# EasyEDA schematic ProiectPM.json

## Sheets
1 Unitatea Centrala: TITLE: Unitatea Centrala; REV: 1.0; Date: 2024-11-15; Sheet: 1/1; Drawn By: ionescucatalin; Company: Your Company
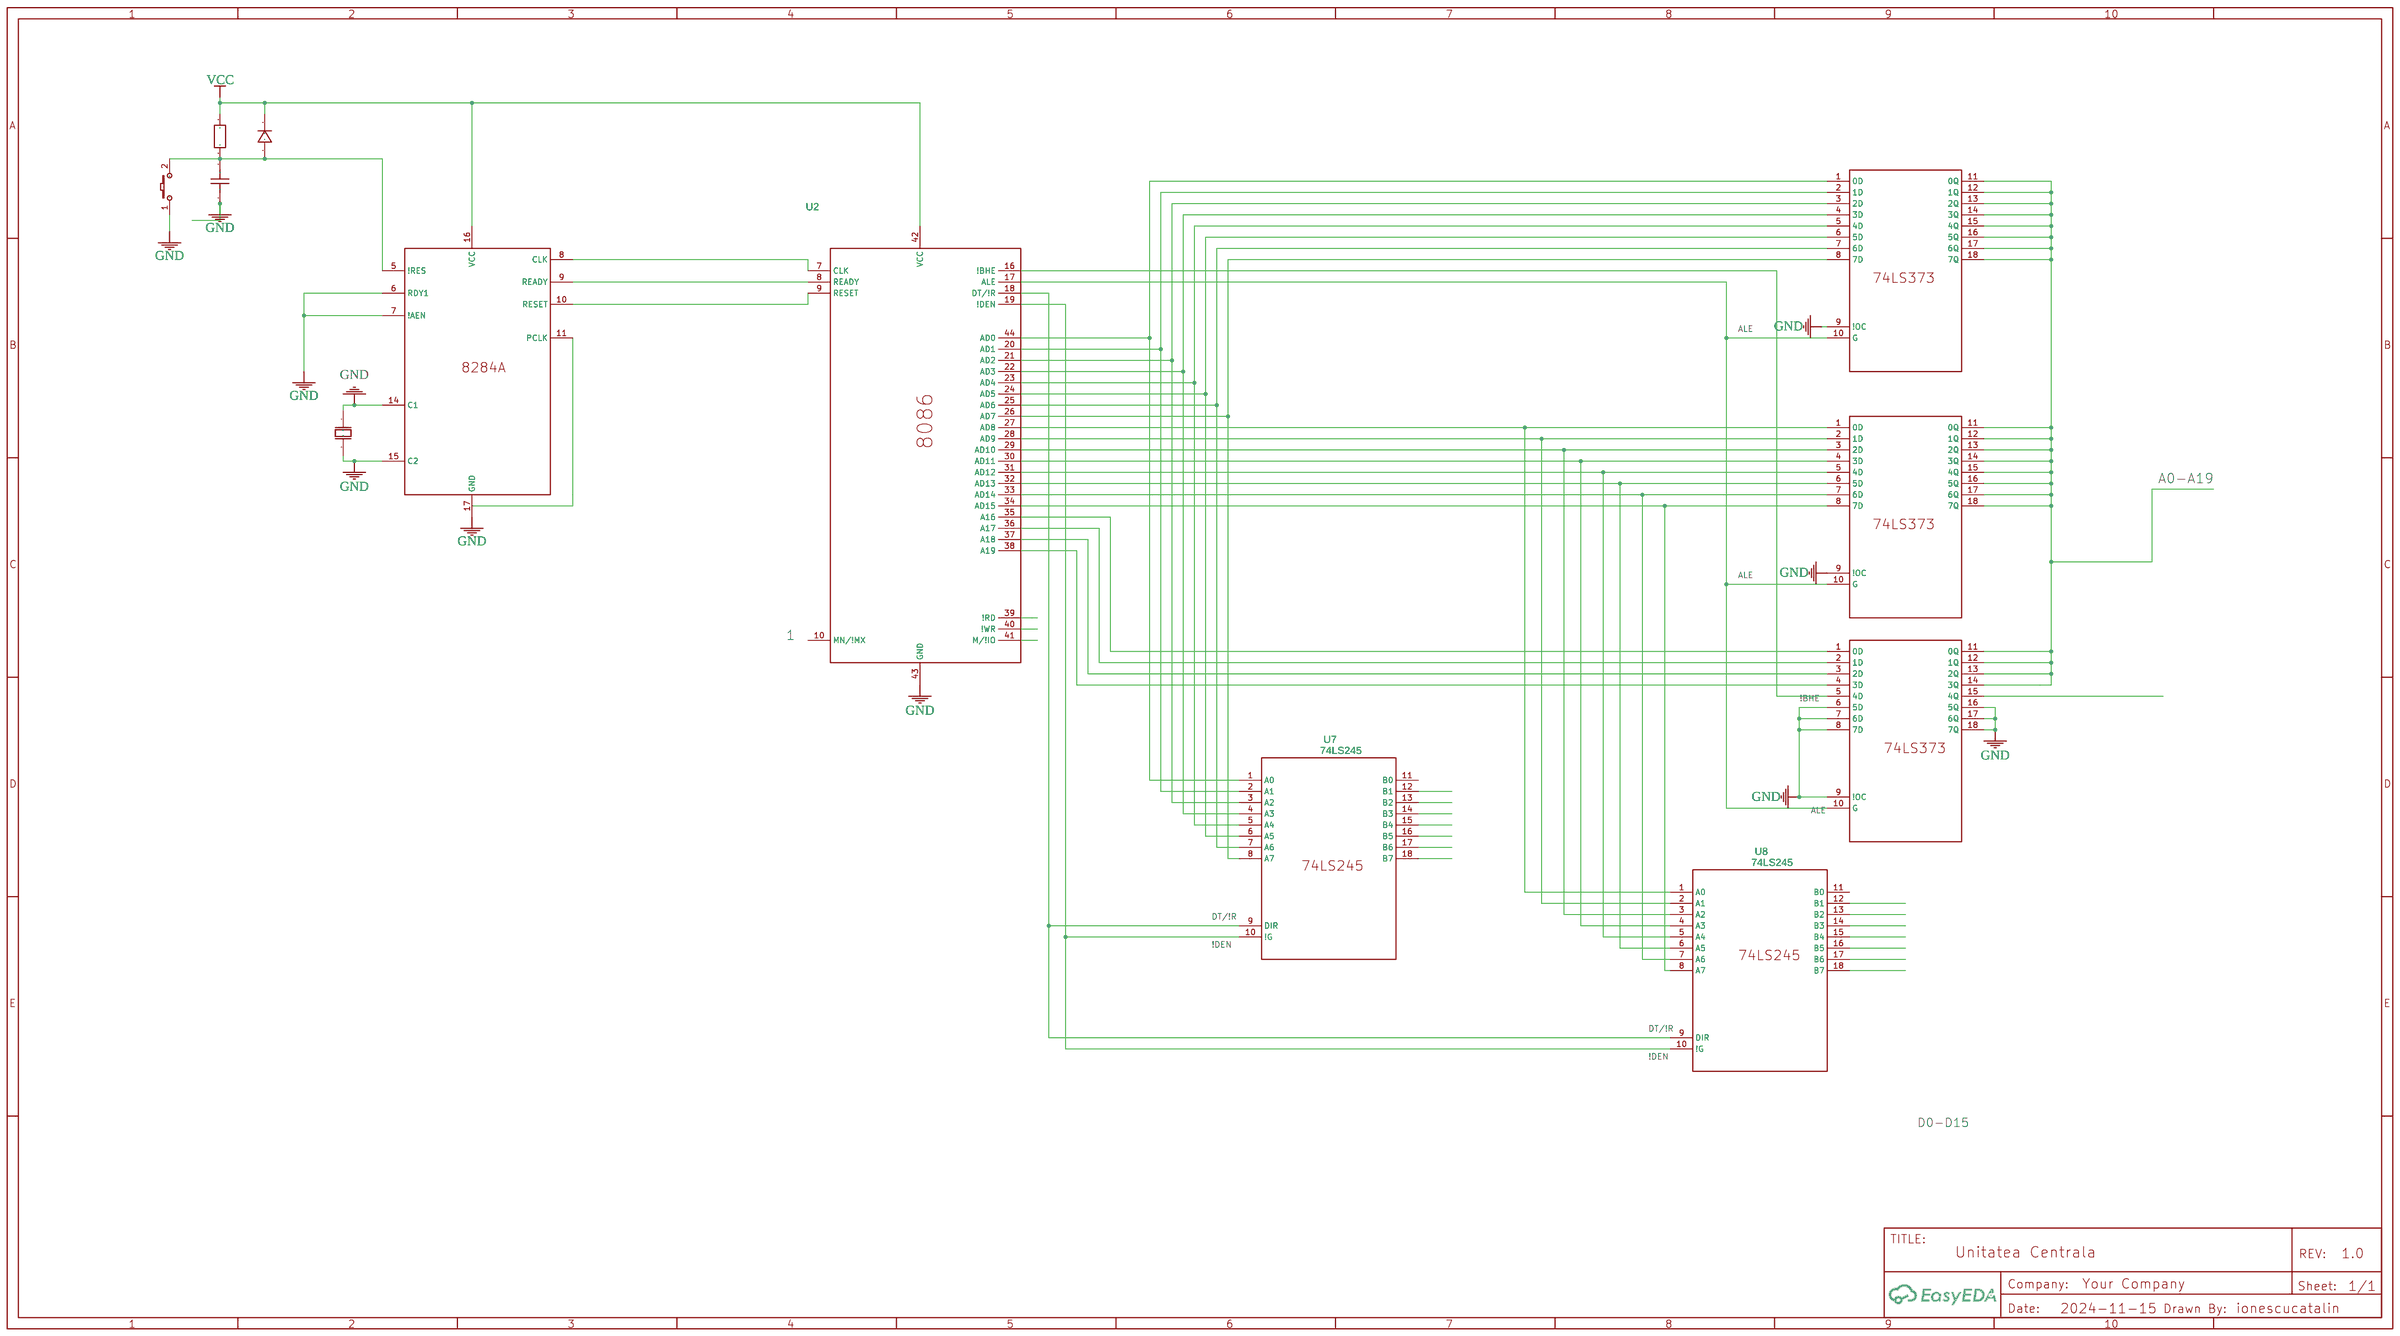
[diagram p0: Unitatea Centrala]
2 ConectareaMemorilor: TITLE: Conectarea Memorilor
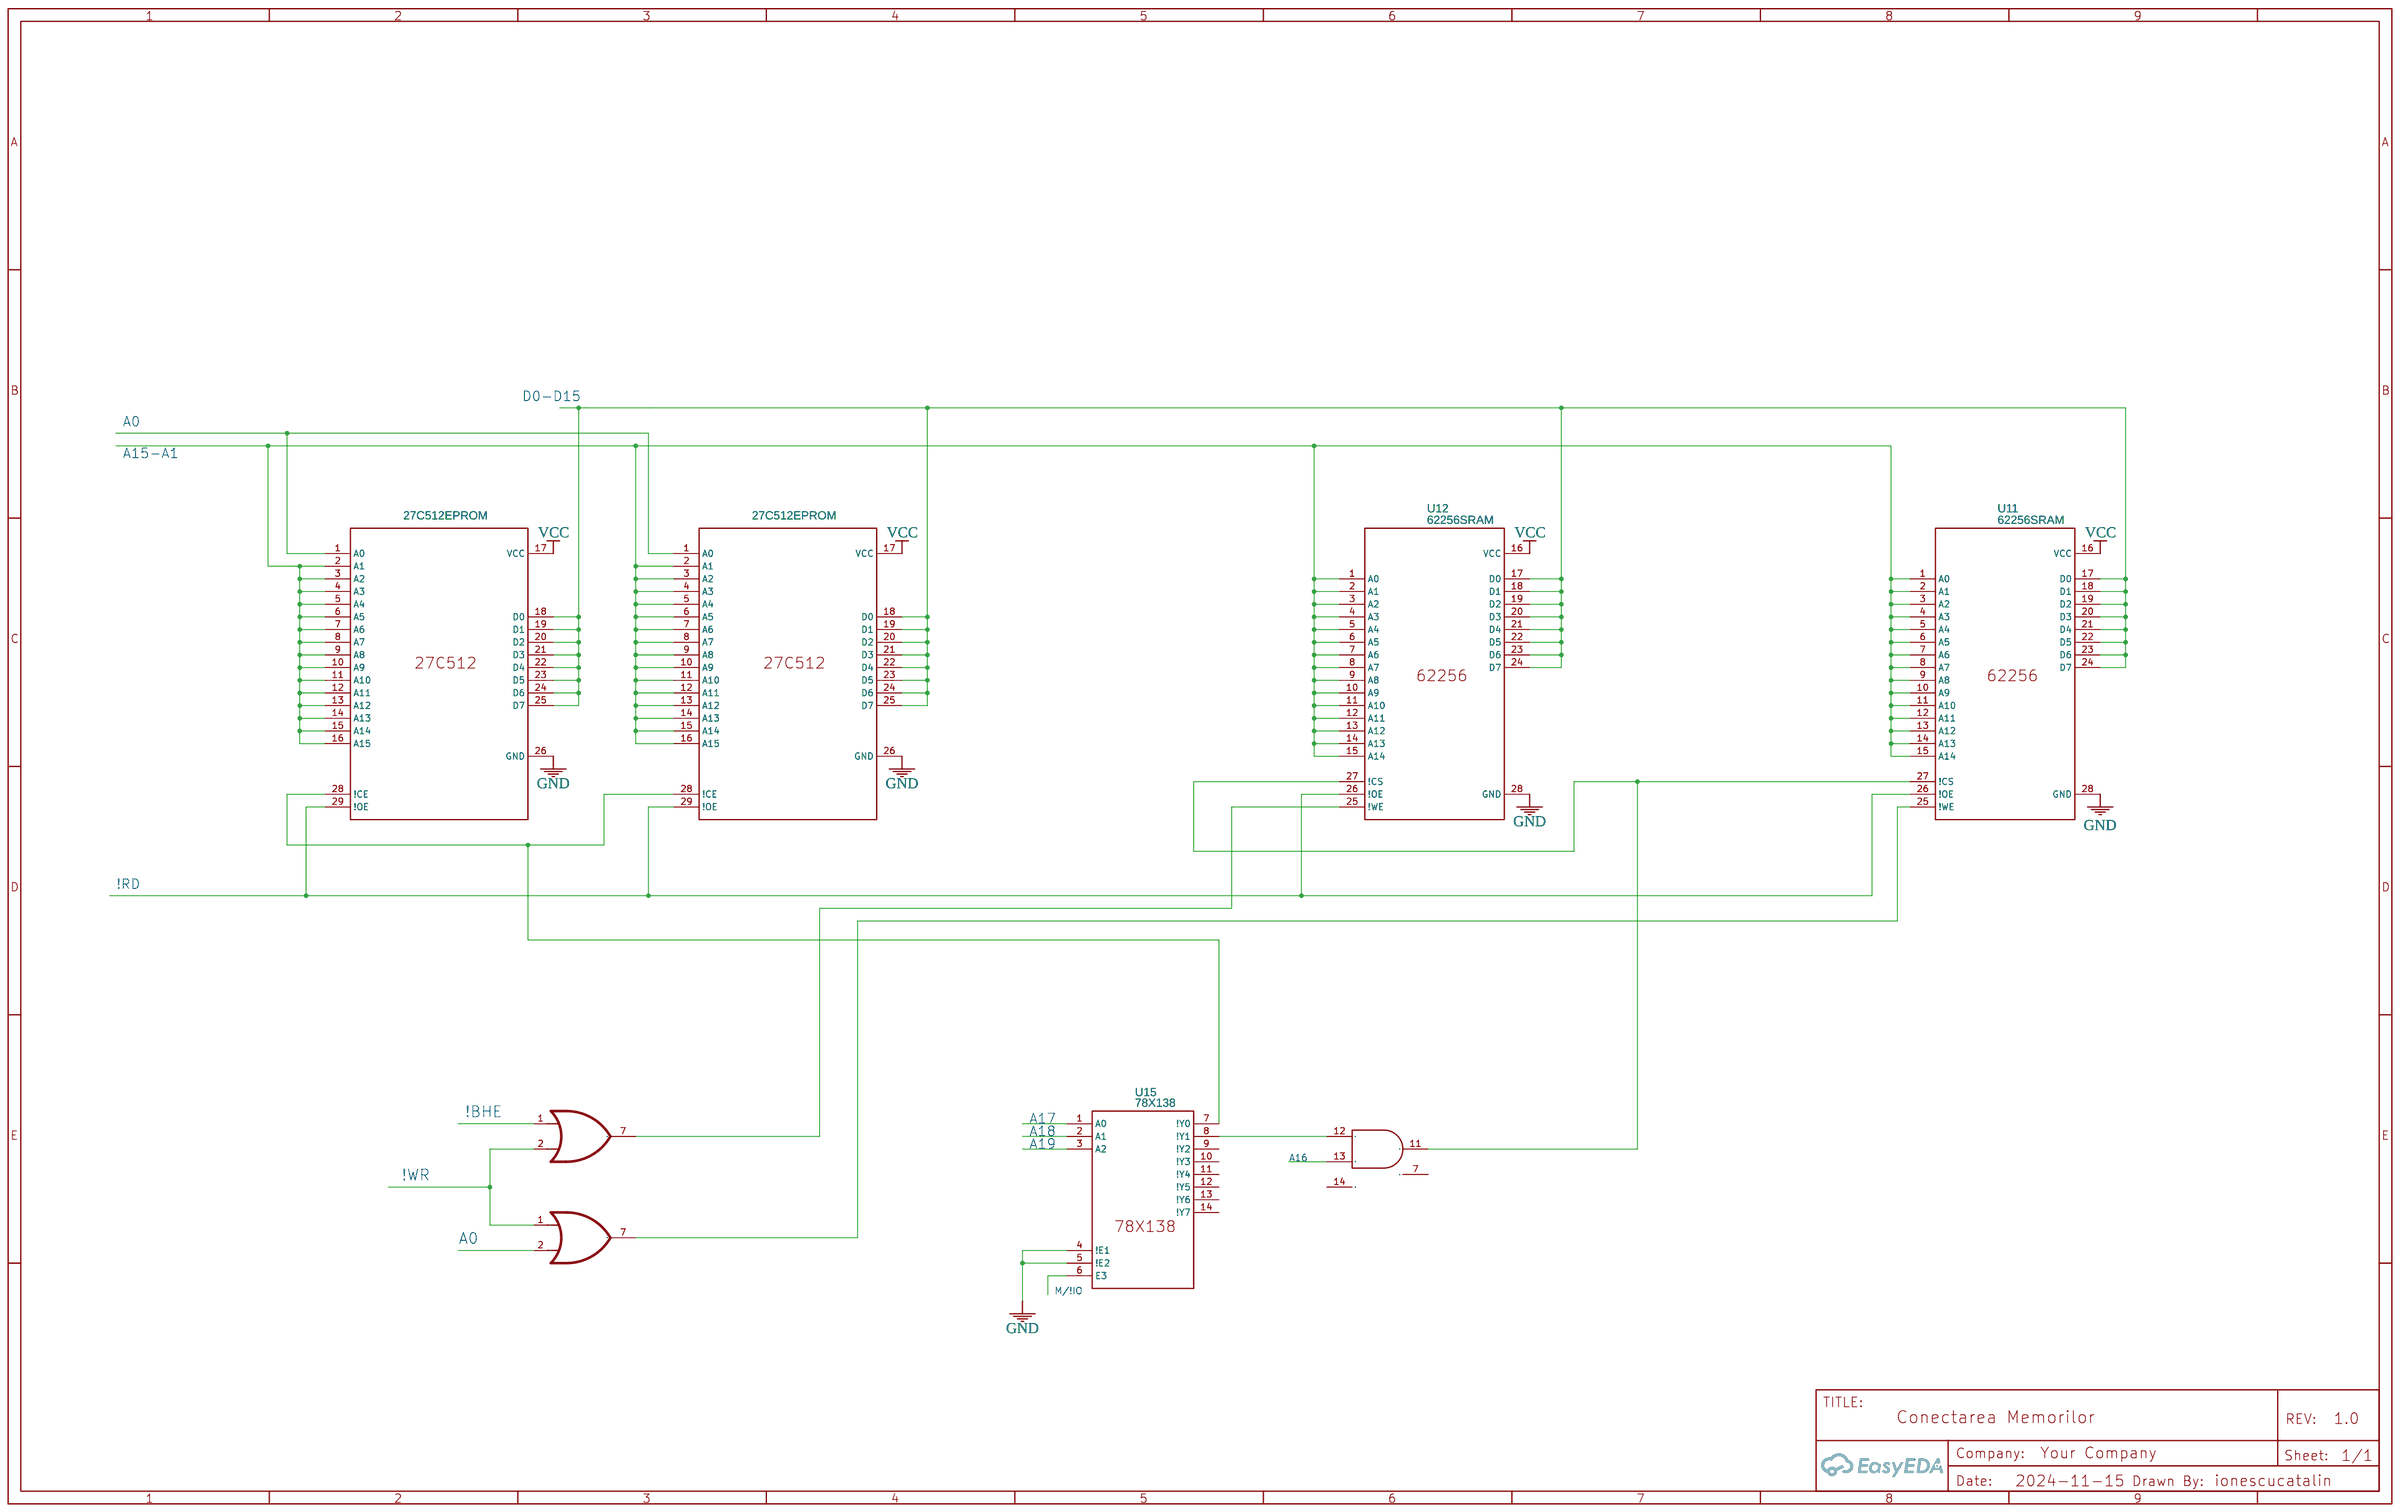
[diagram p1: ConectareaMemorilor]
3 DECINTERFATASERIALAPARA: TITLE: Decodificare Interfata Ser - Para; Date: 2024-11-18
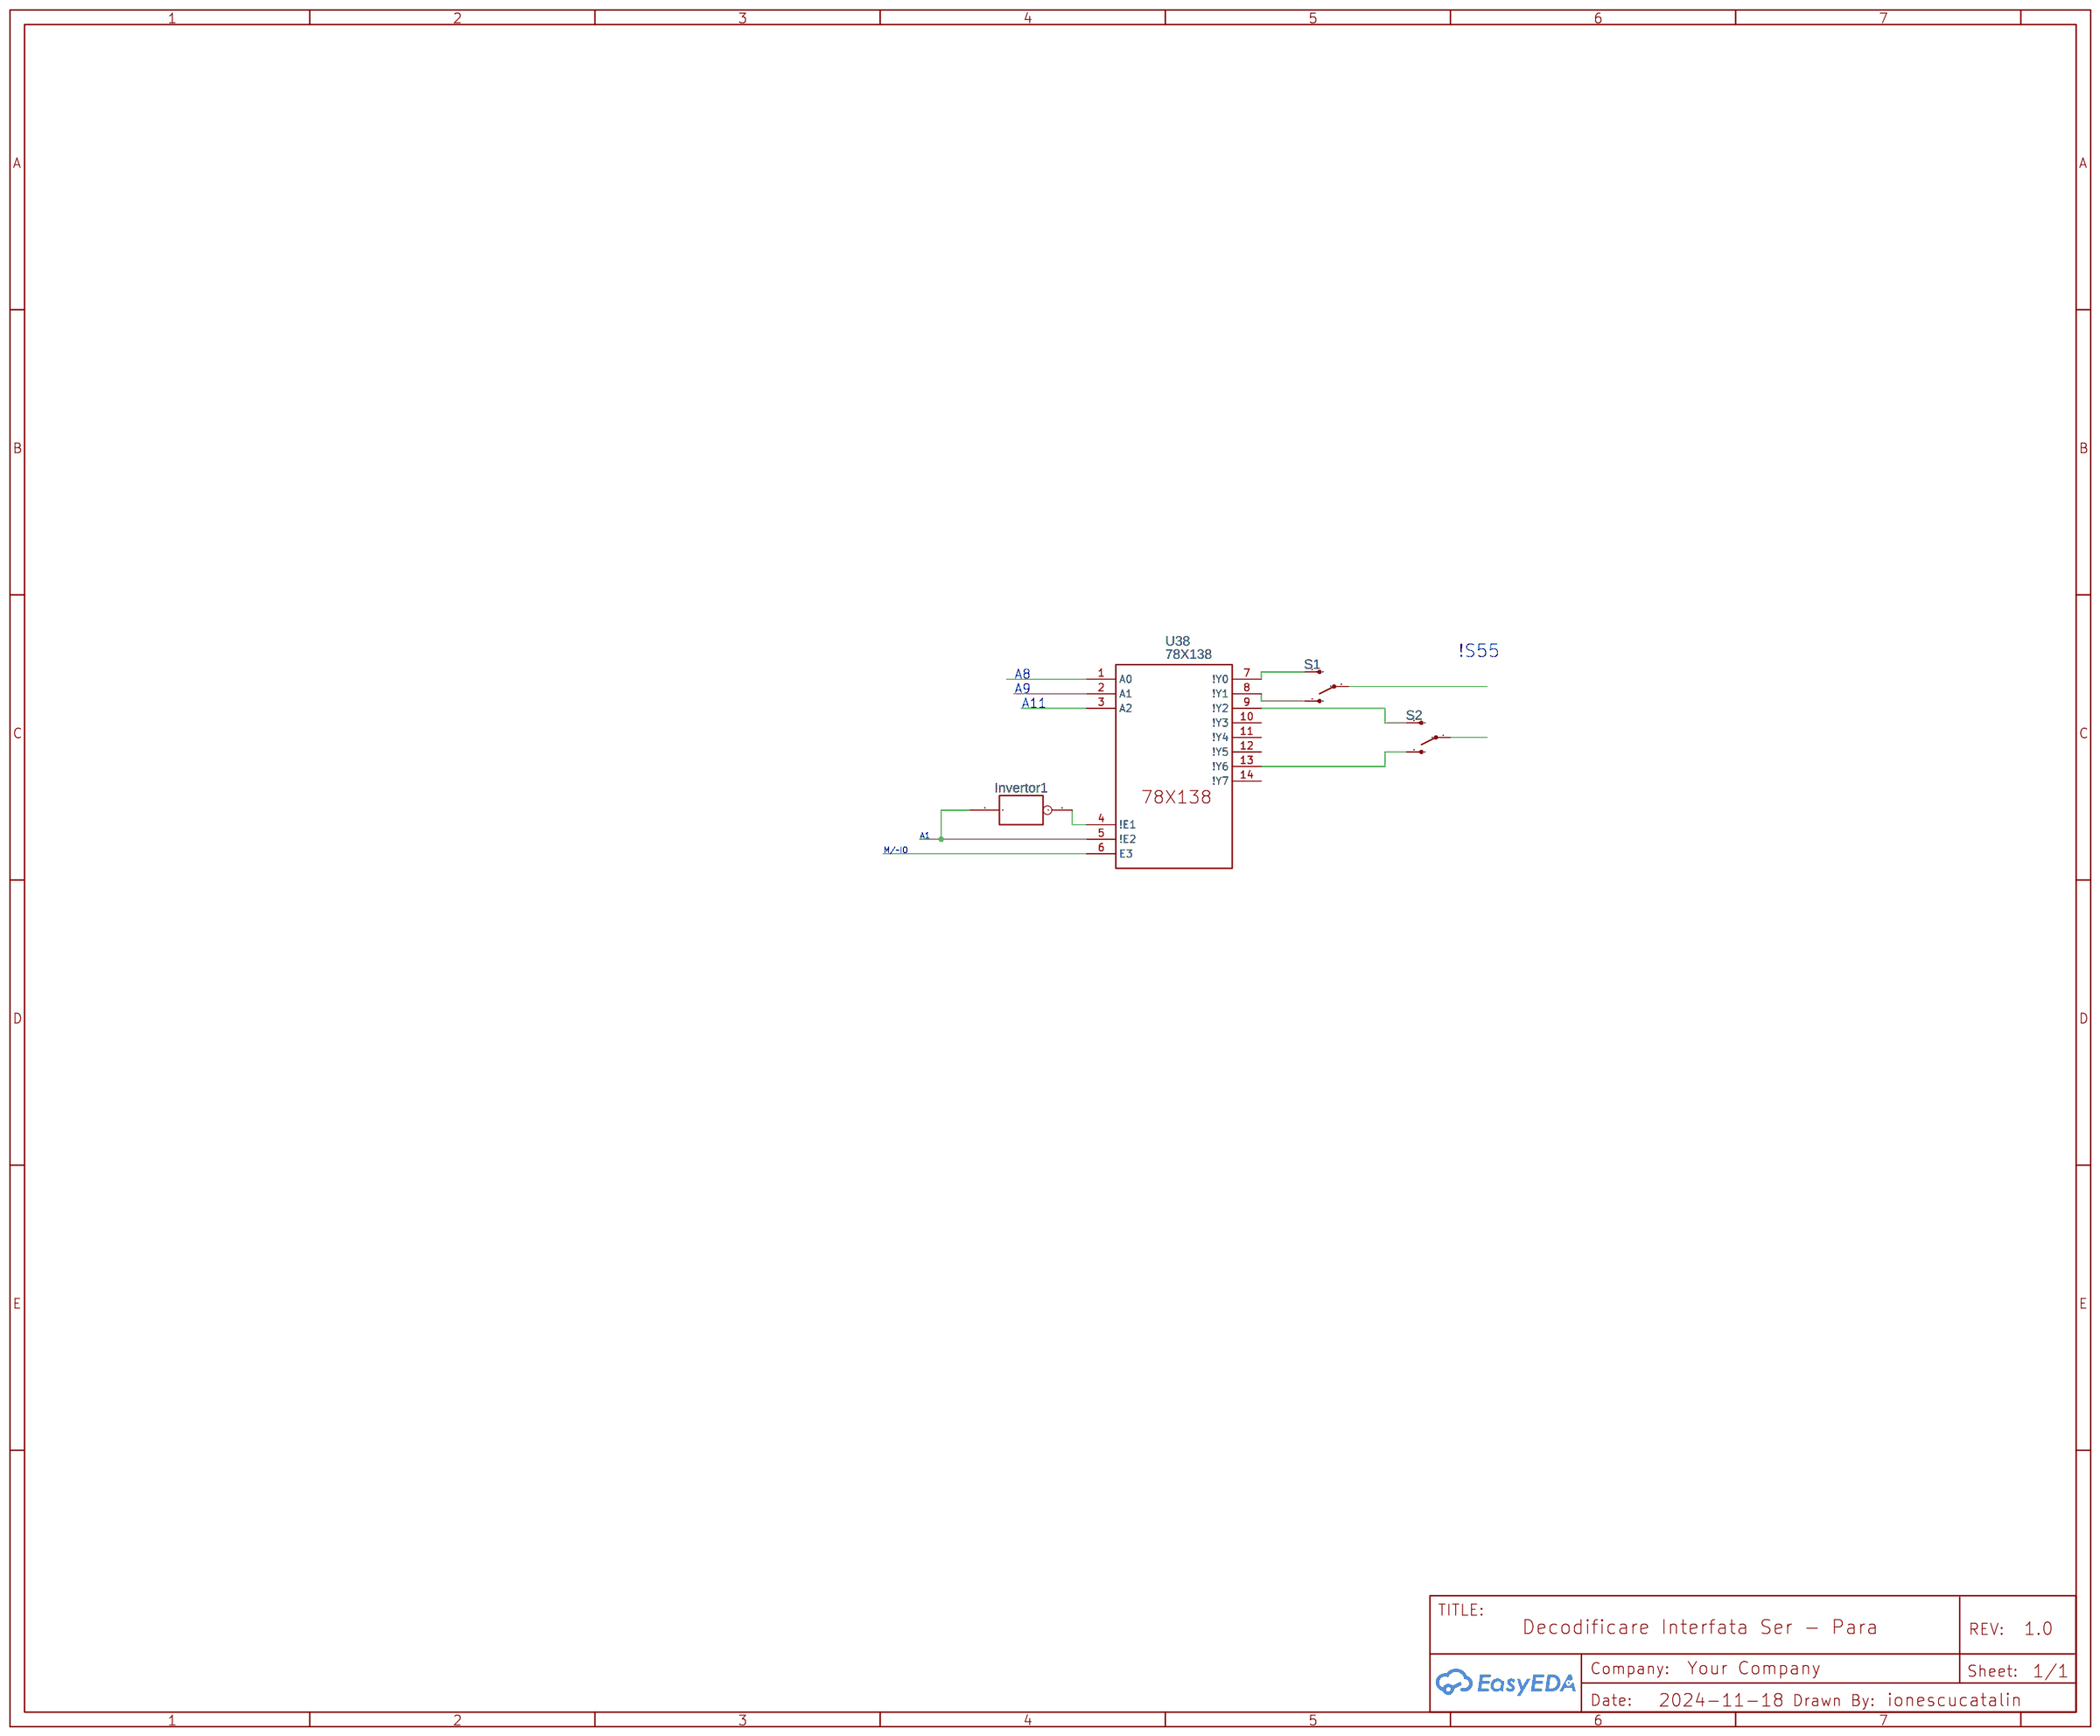
[diagram p2: DECINTERFATASERIALAPARA]
4 InterfataParalelaSeriala: TITLE: Sheet_1; Date: 2024-11-19
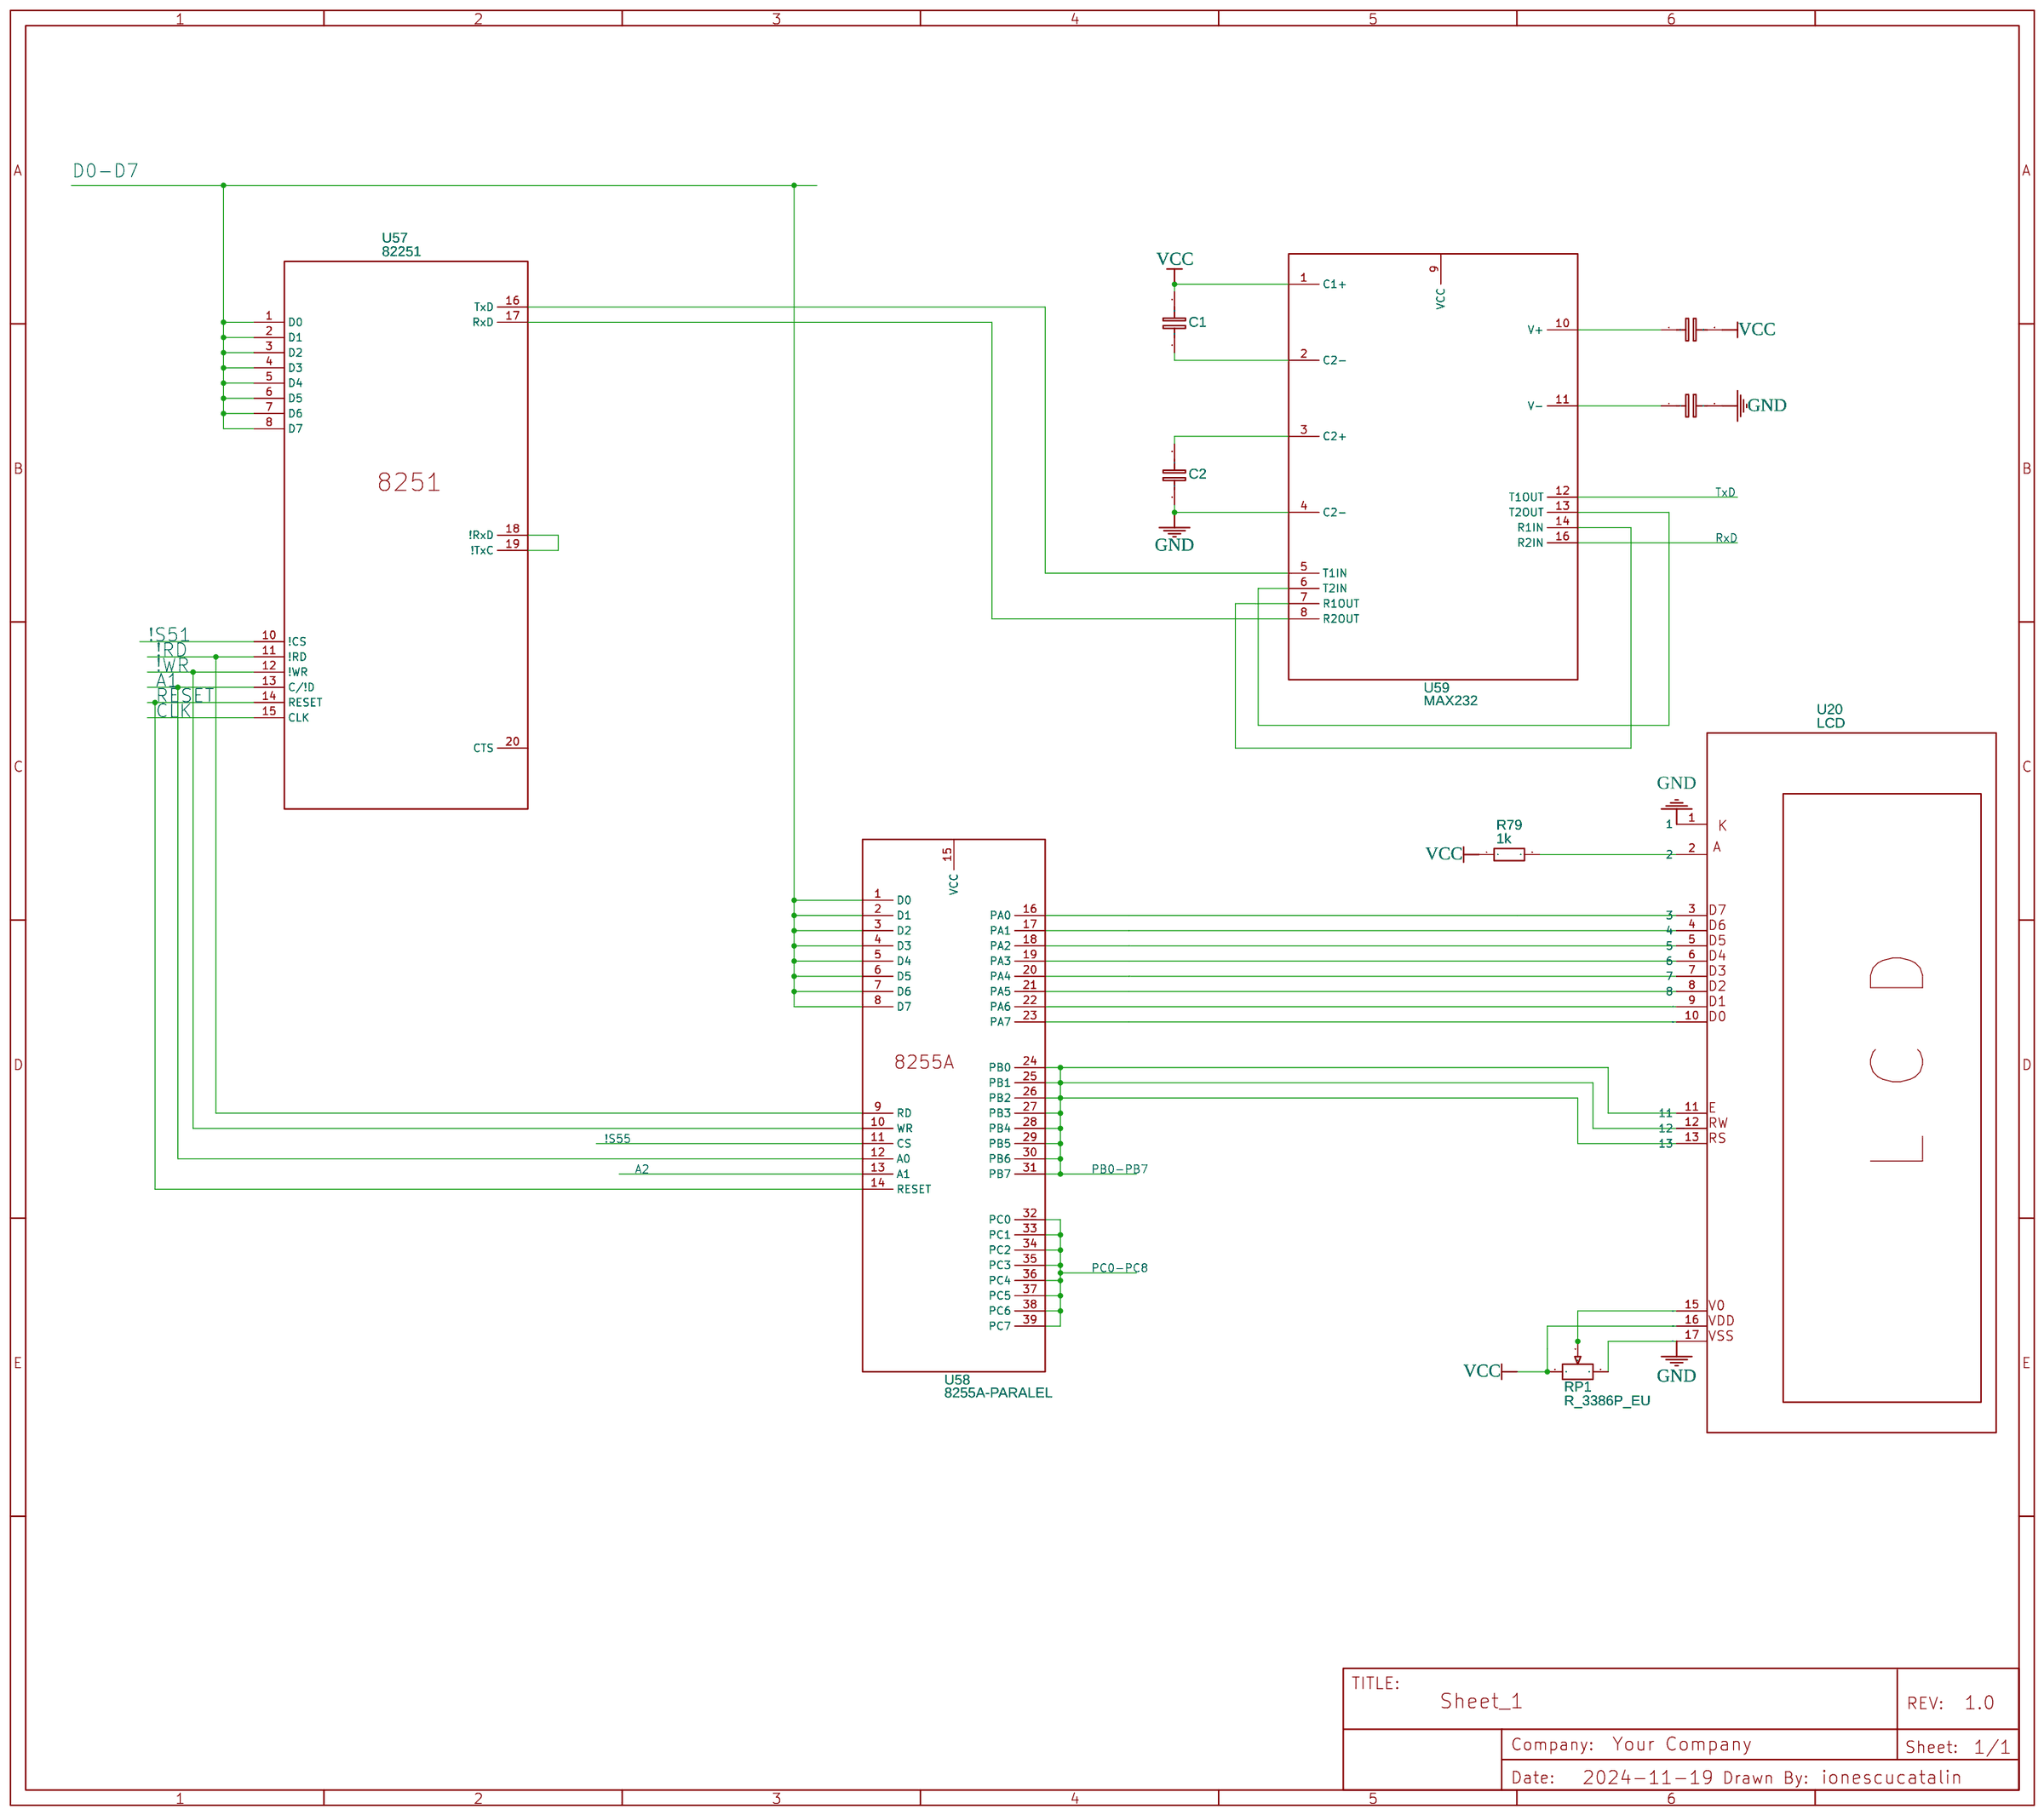
[diagram p3: InterfataParalelaSeriala]
5 MiniTast: TITLE: Minitastatura; Date: 2024-12-10
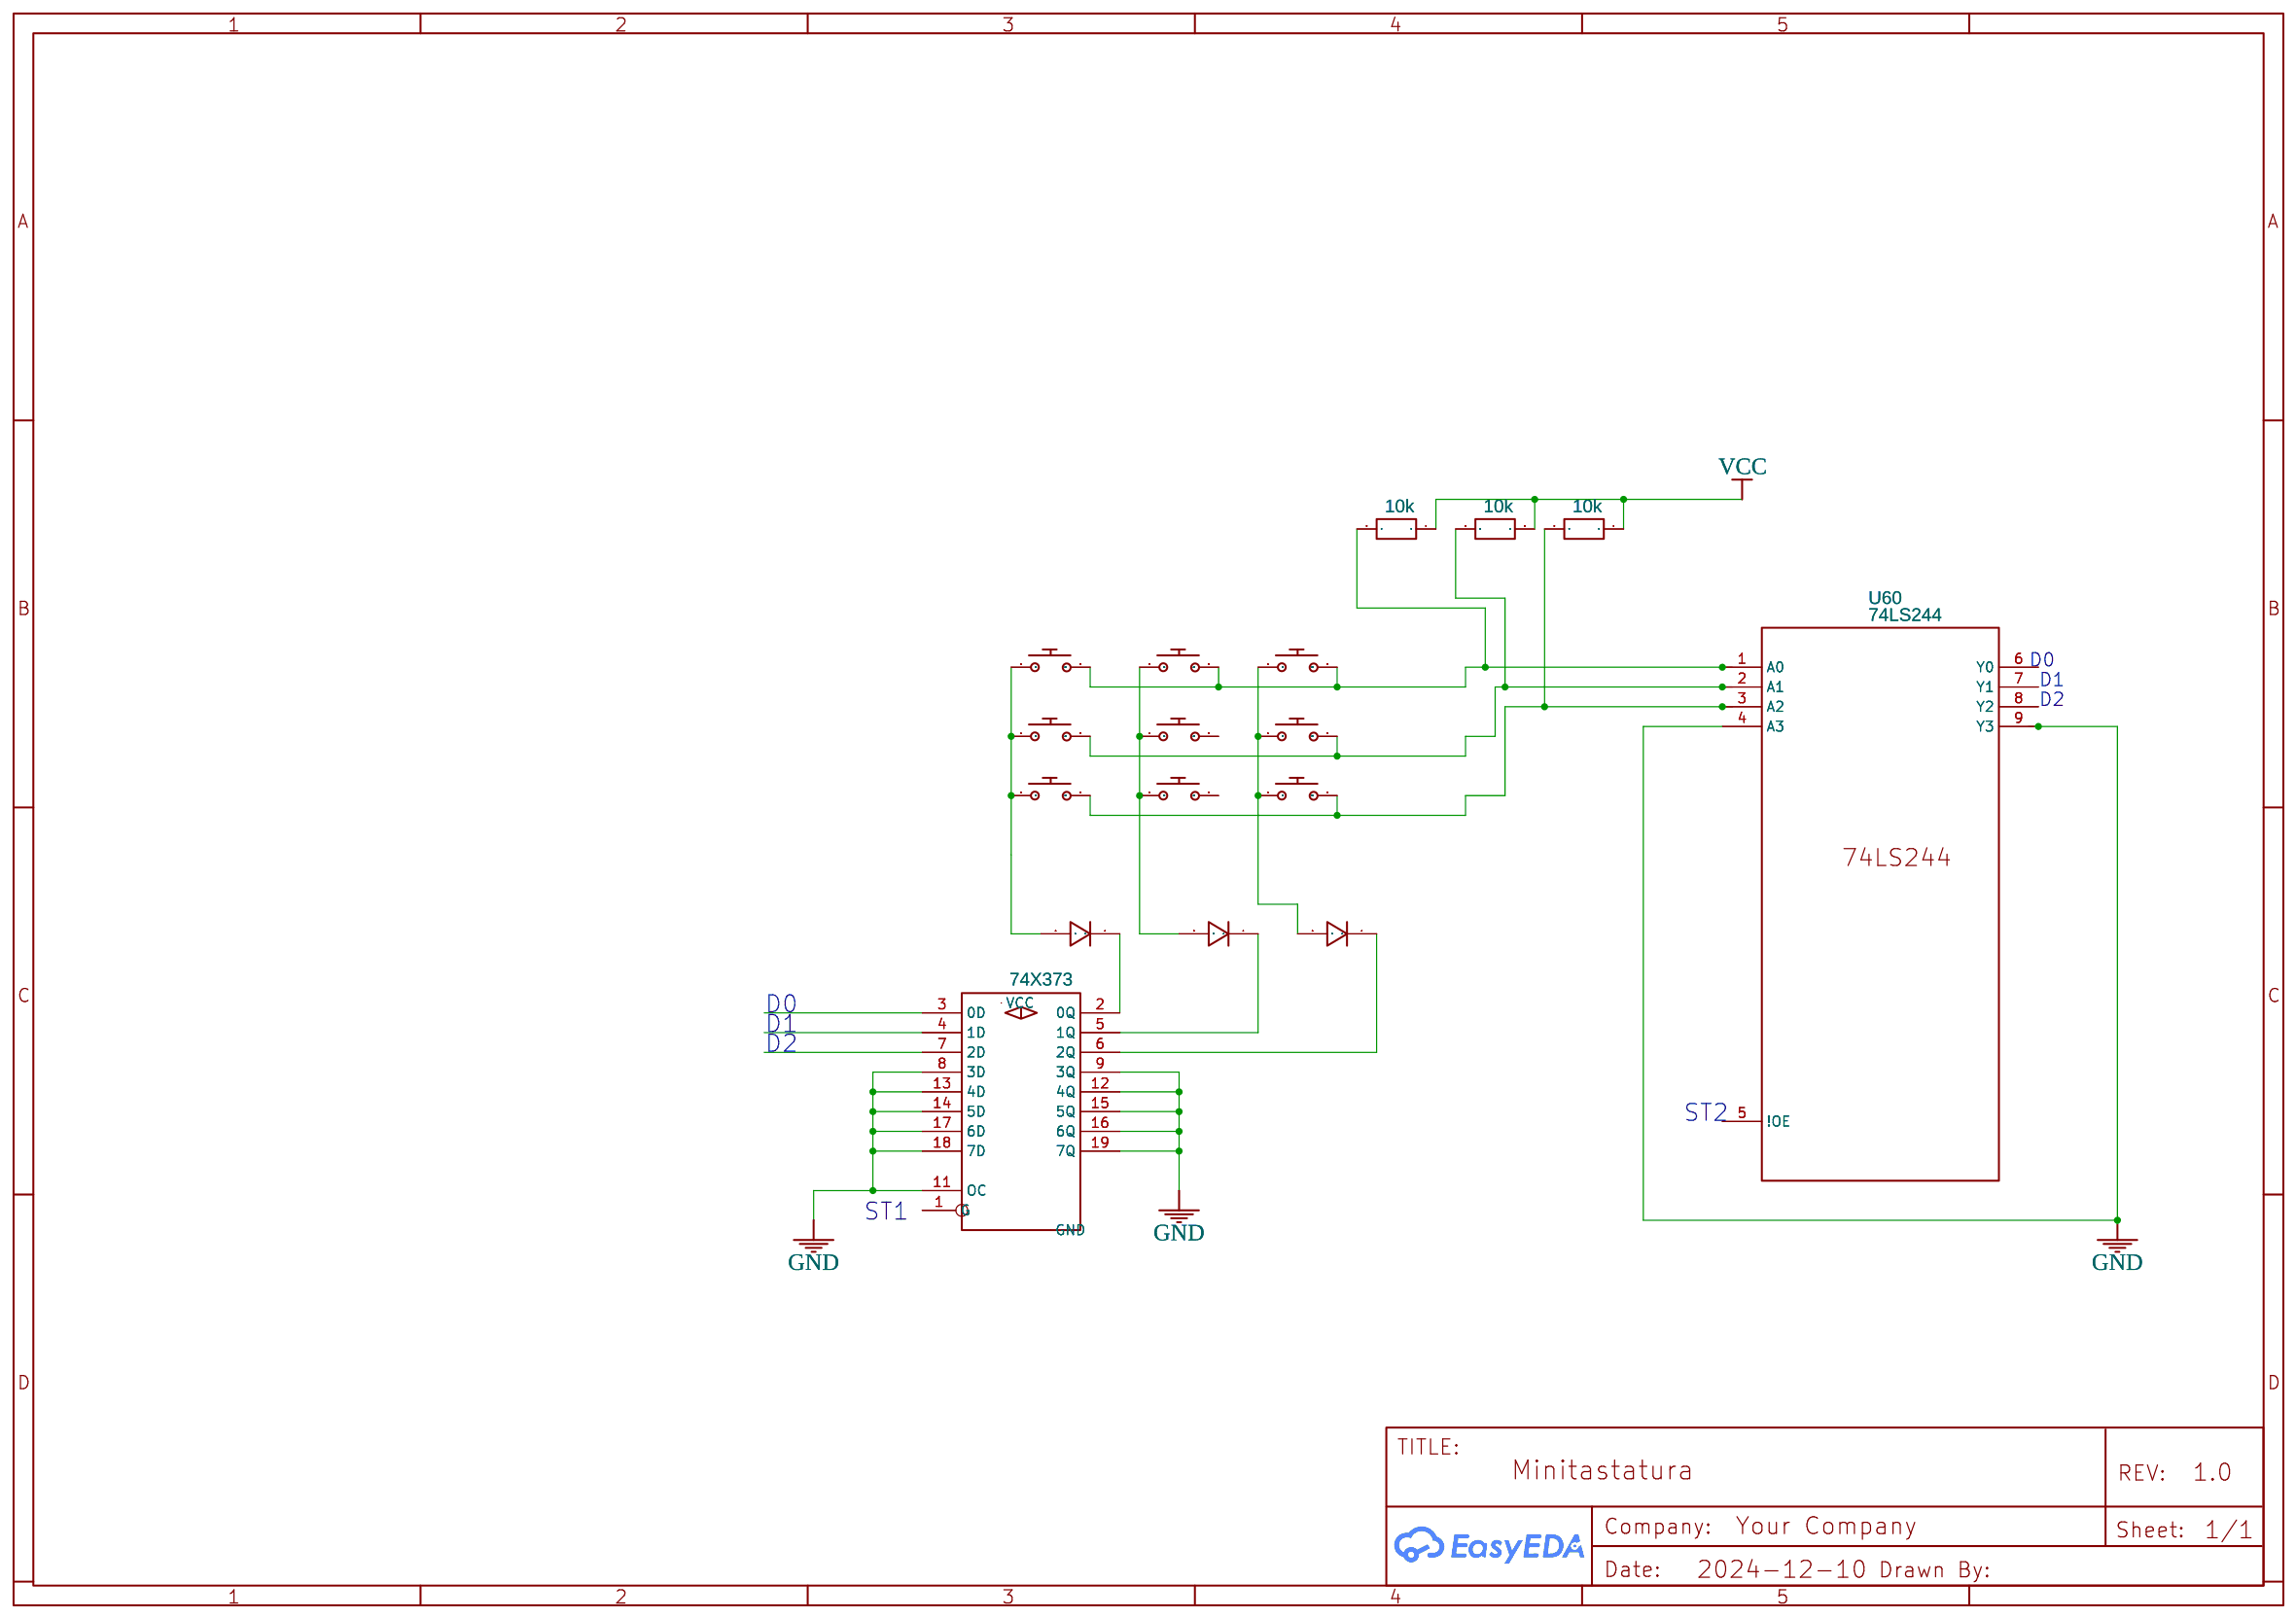
[diagram p4: MiniTast]
6 LED-URI: TITLE: Sheet_1; Date: 2024-12-11
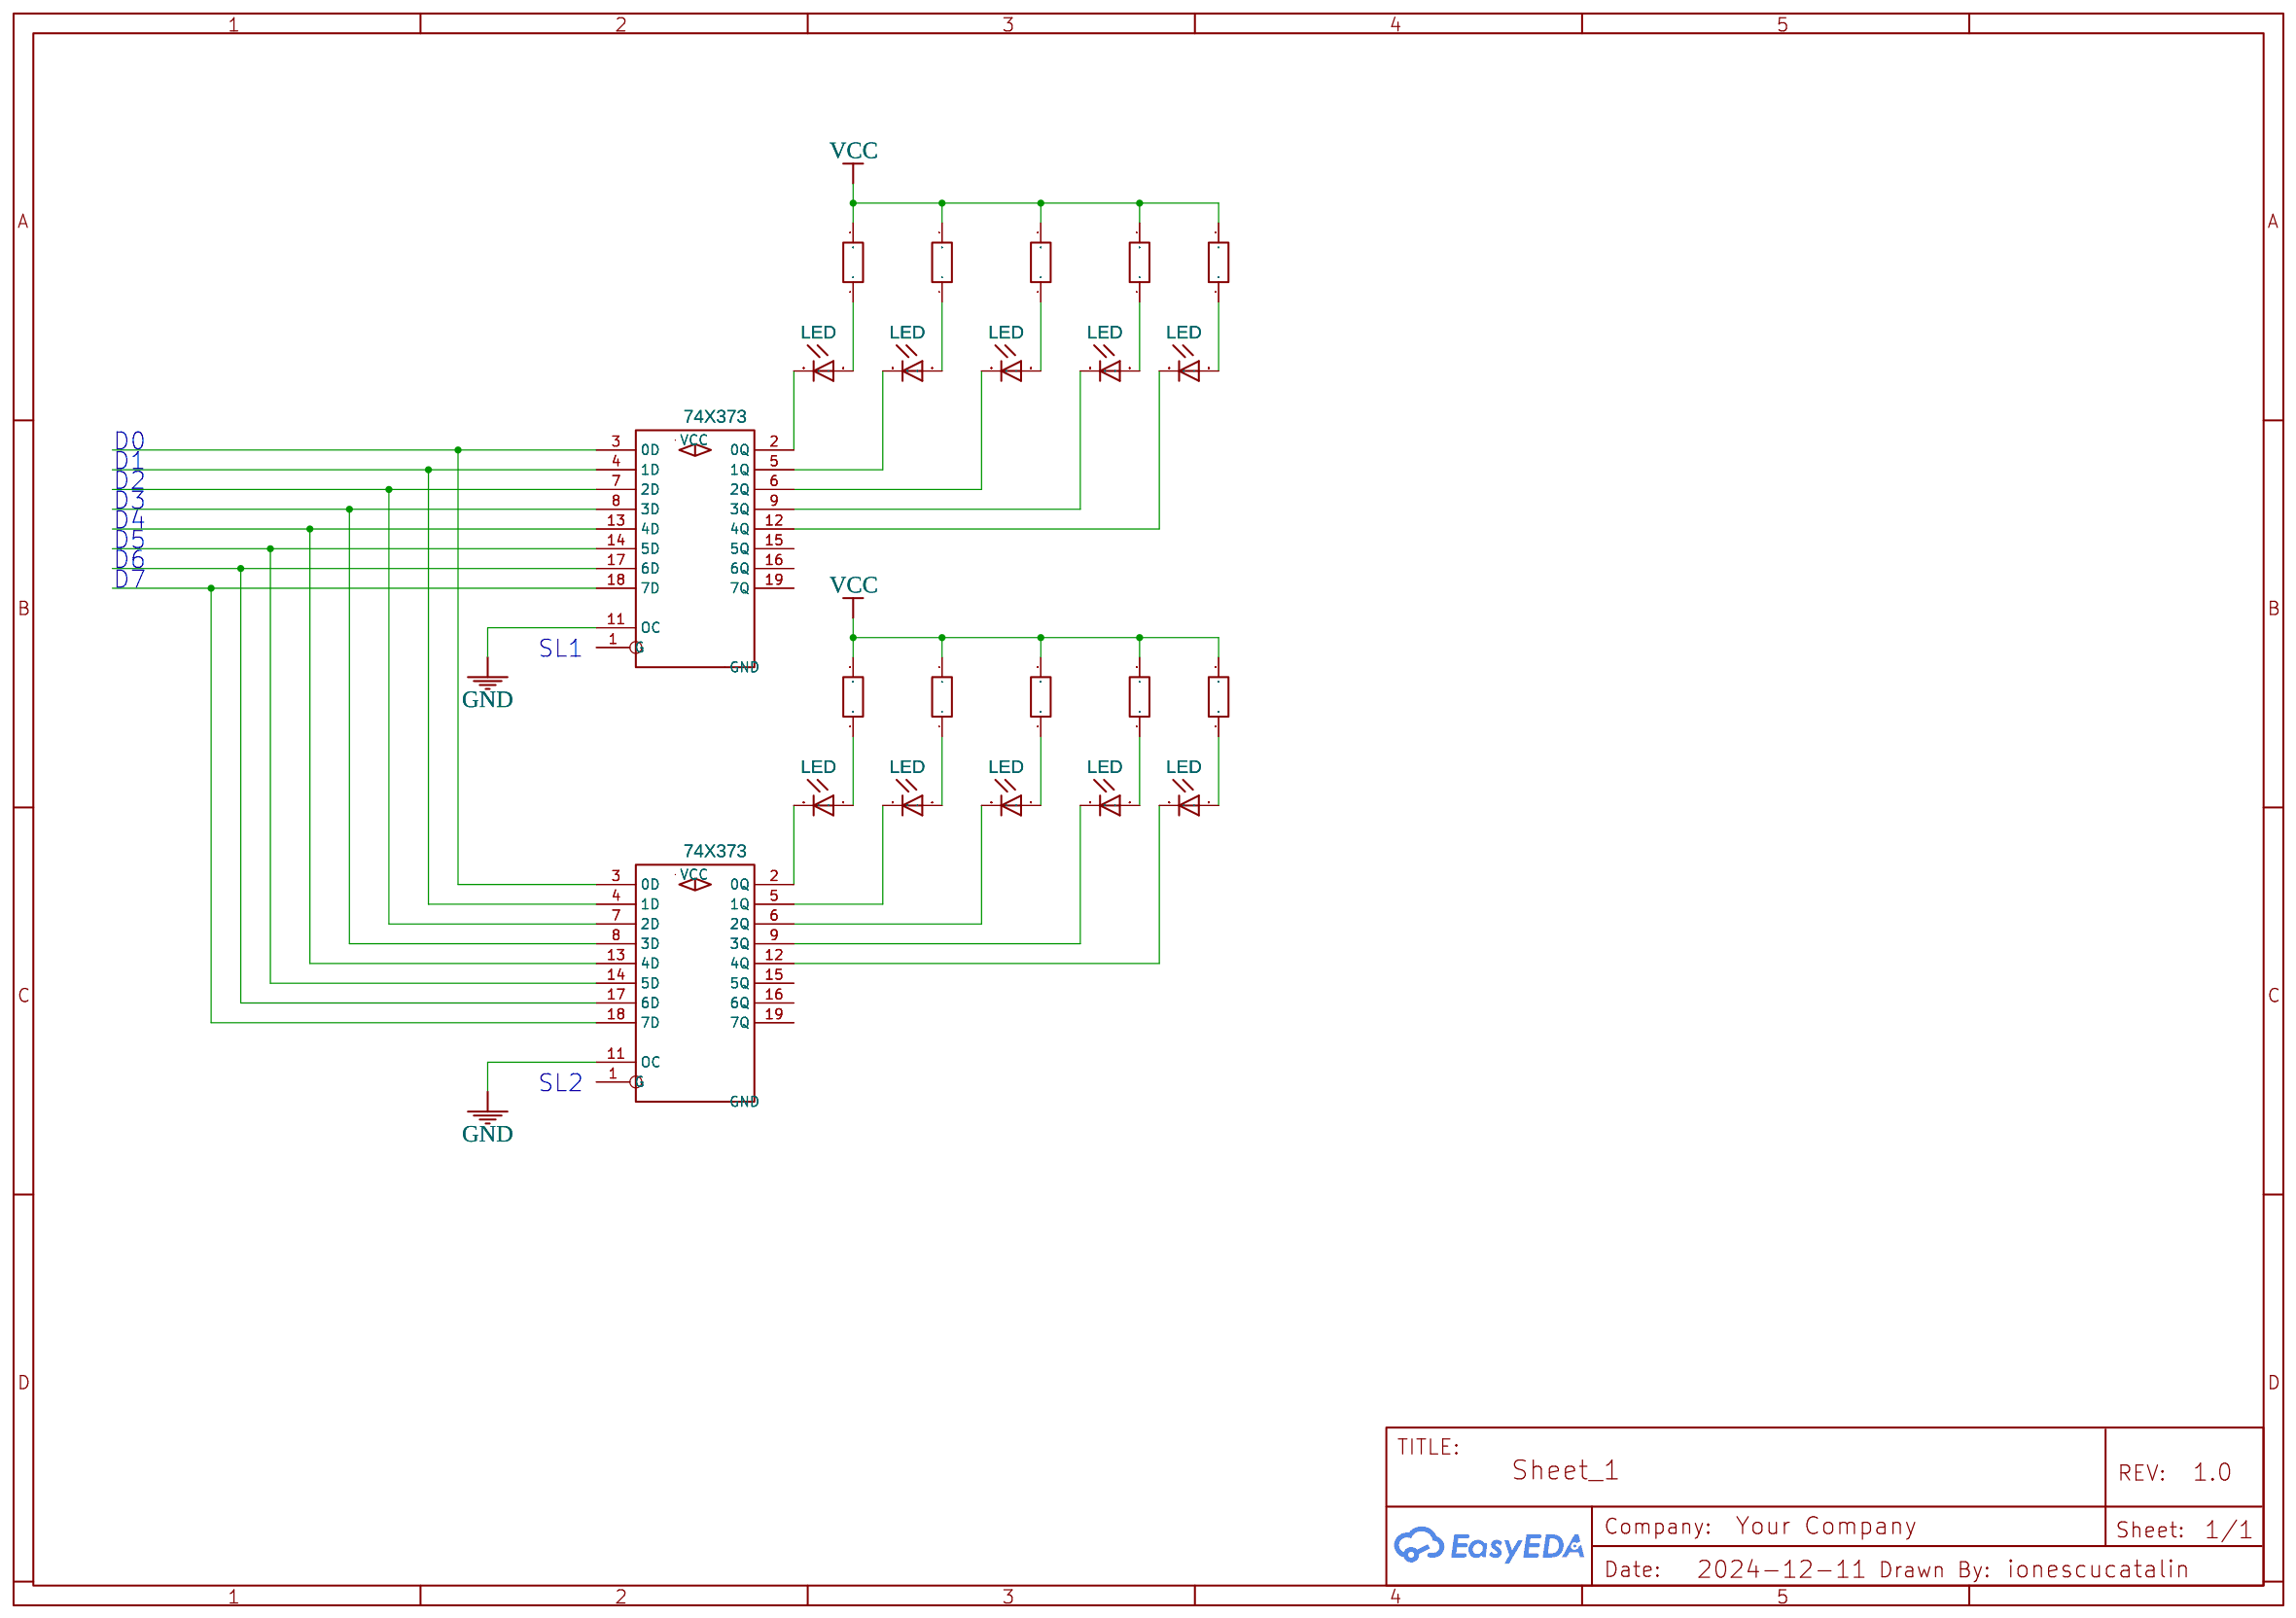
[diagram p5: LED-URI]
7 7segdisplay: TITLE: Sheet_1; Date: 2024-12-11
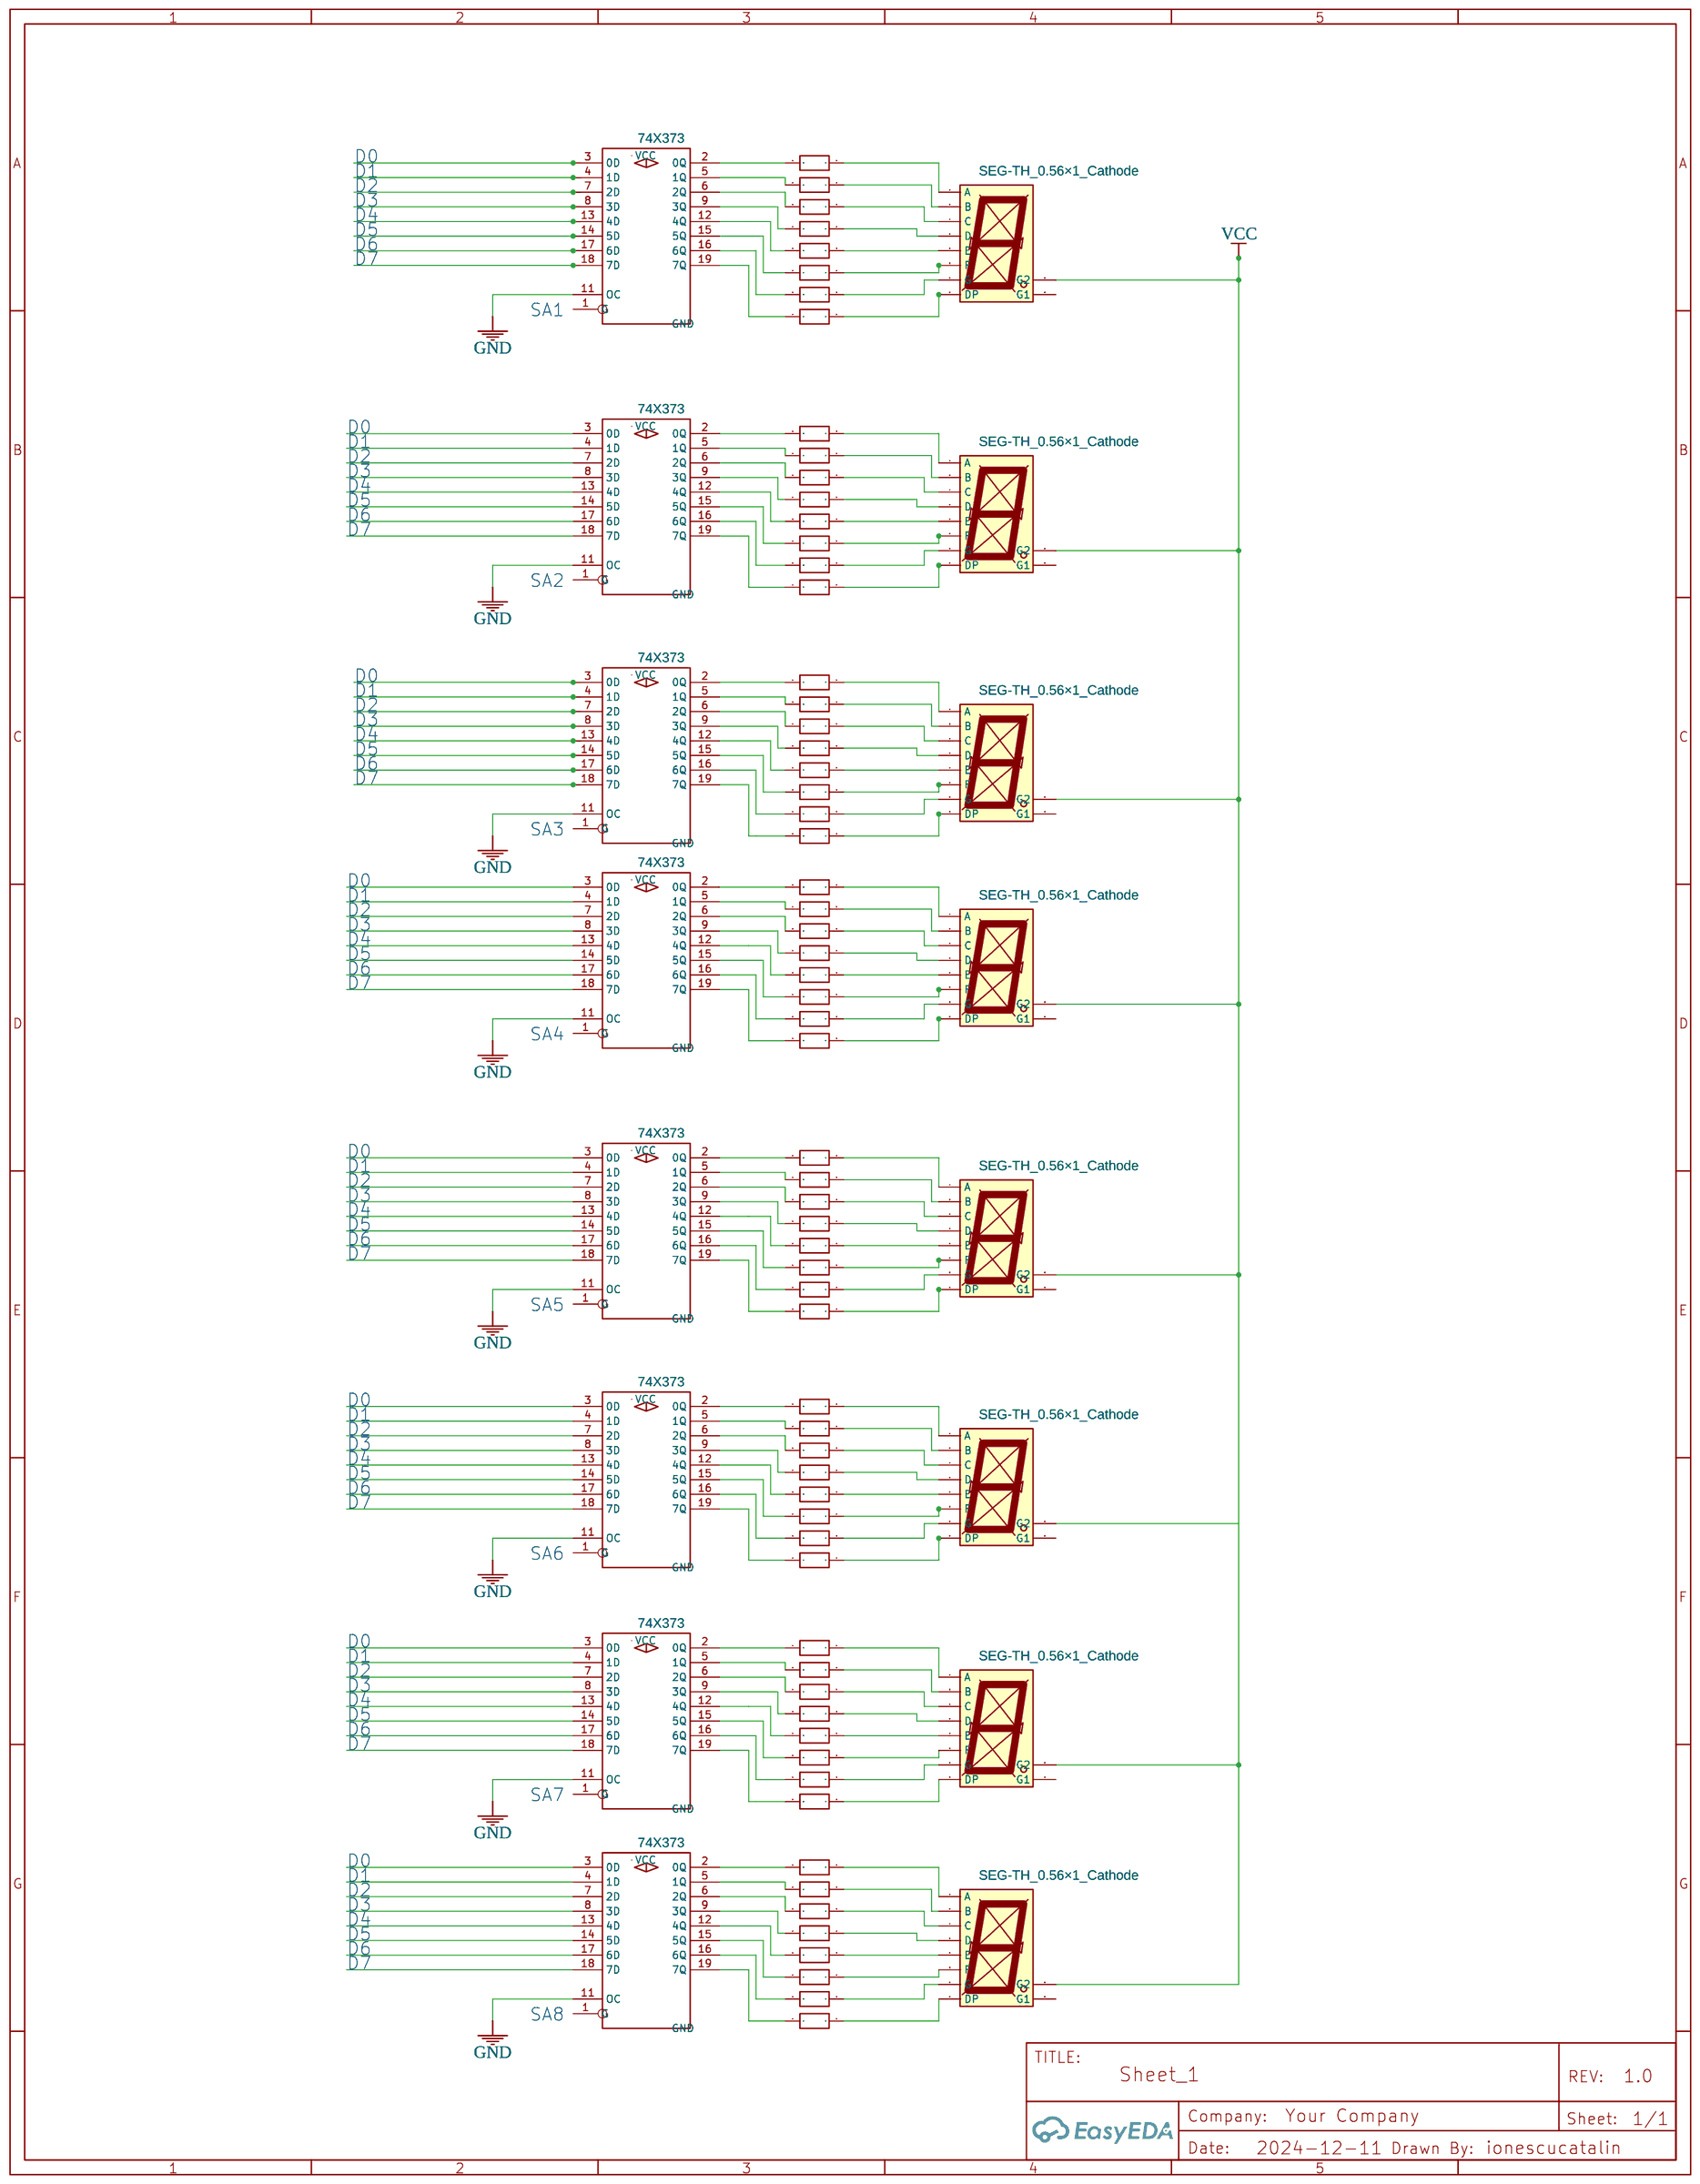
[diagram p6: 7segdisplay]
8 Porturi_dec: TITLE: Decodificare_porturi; Date: 2025-01-06
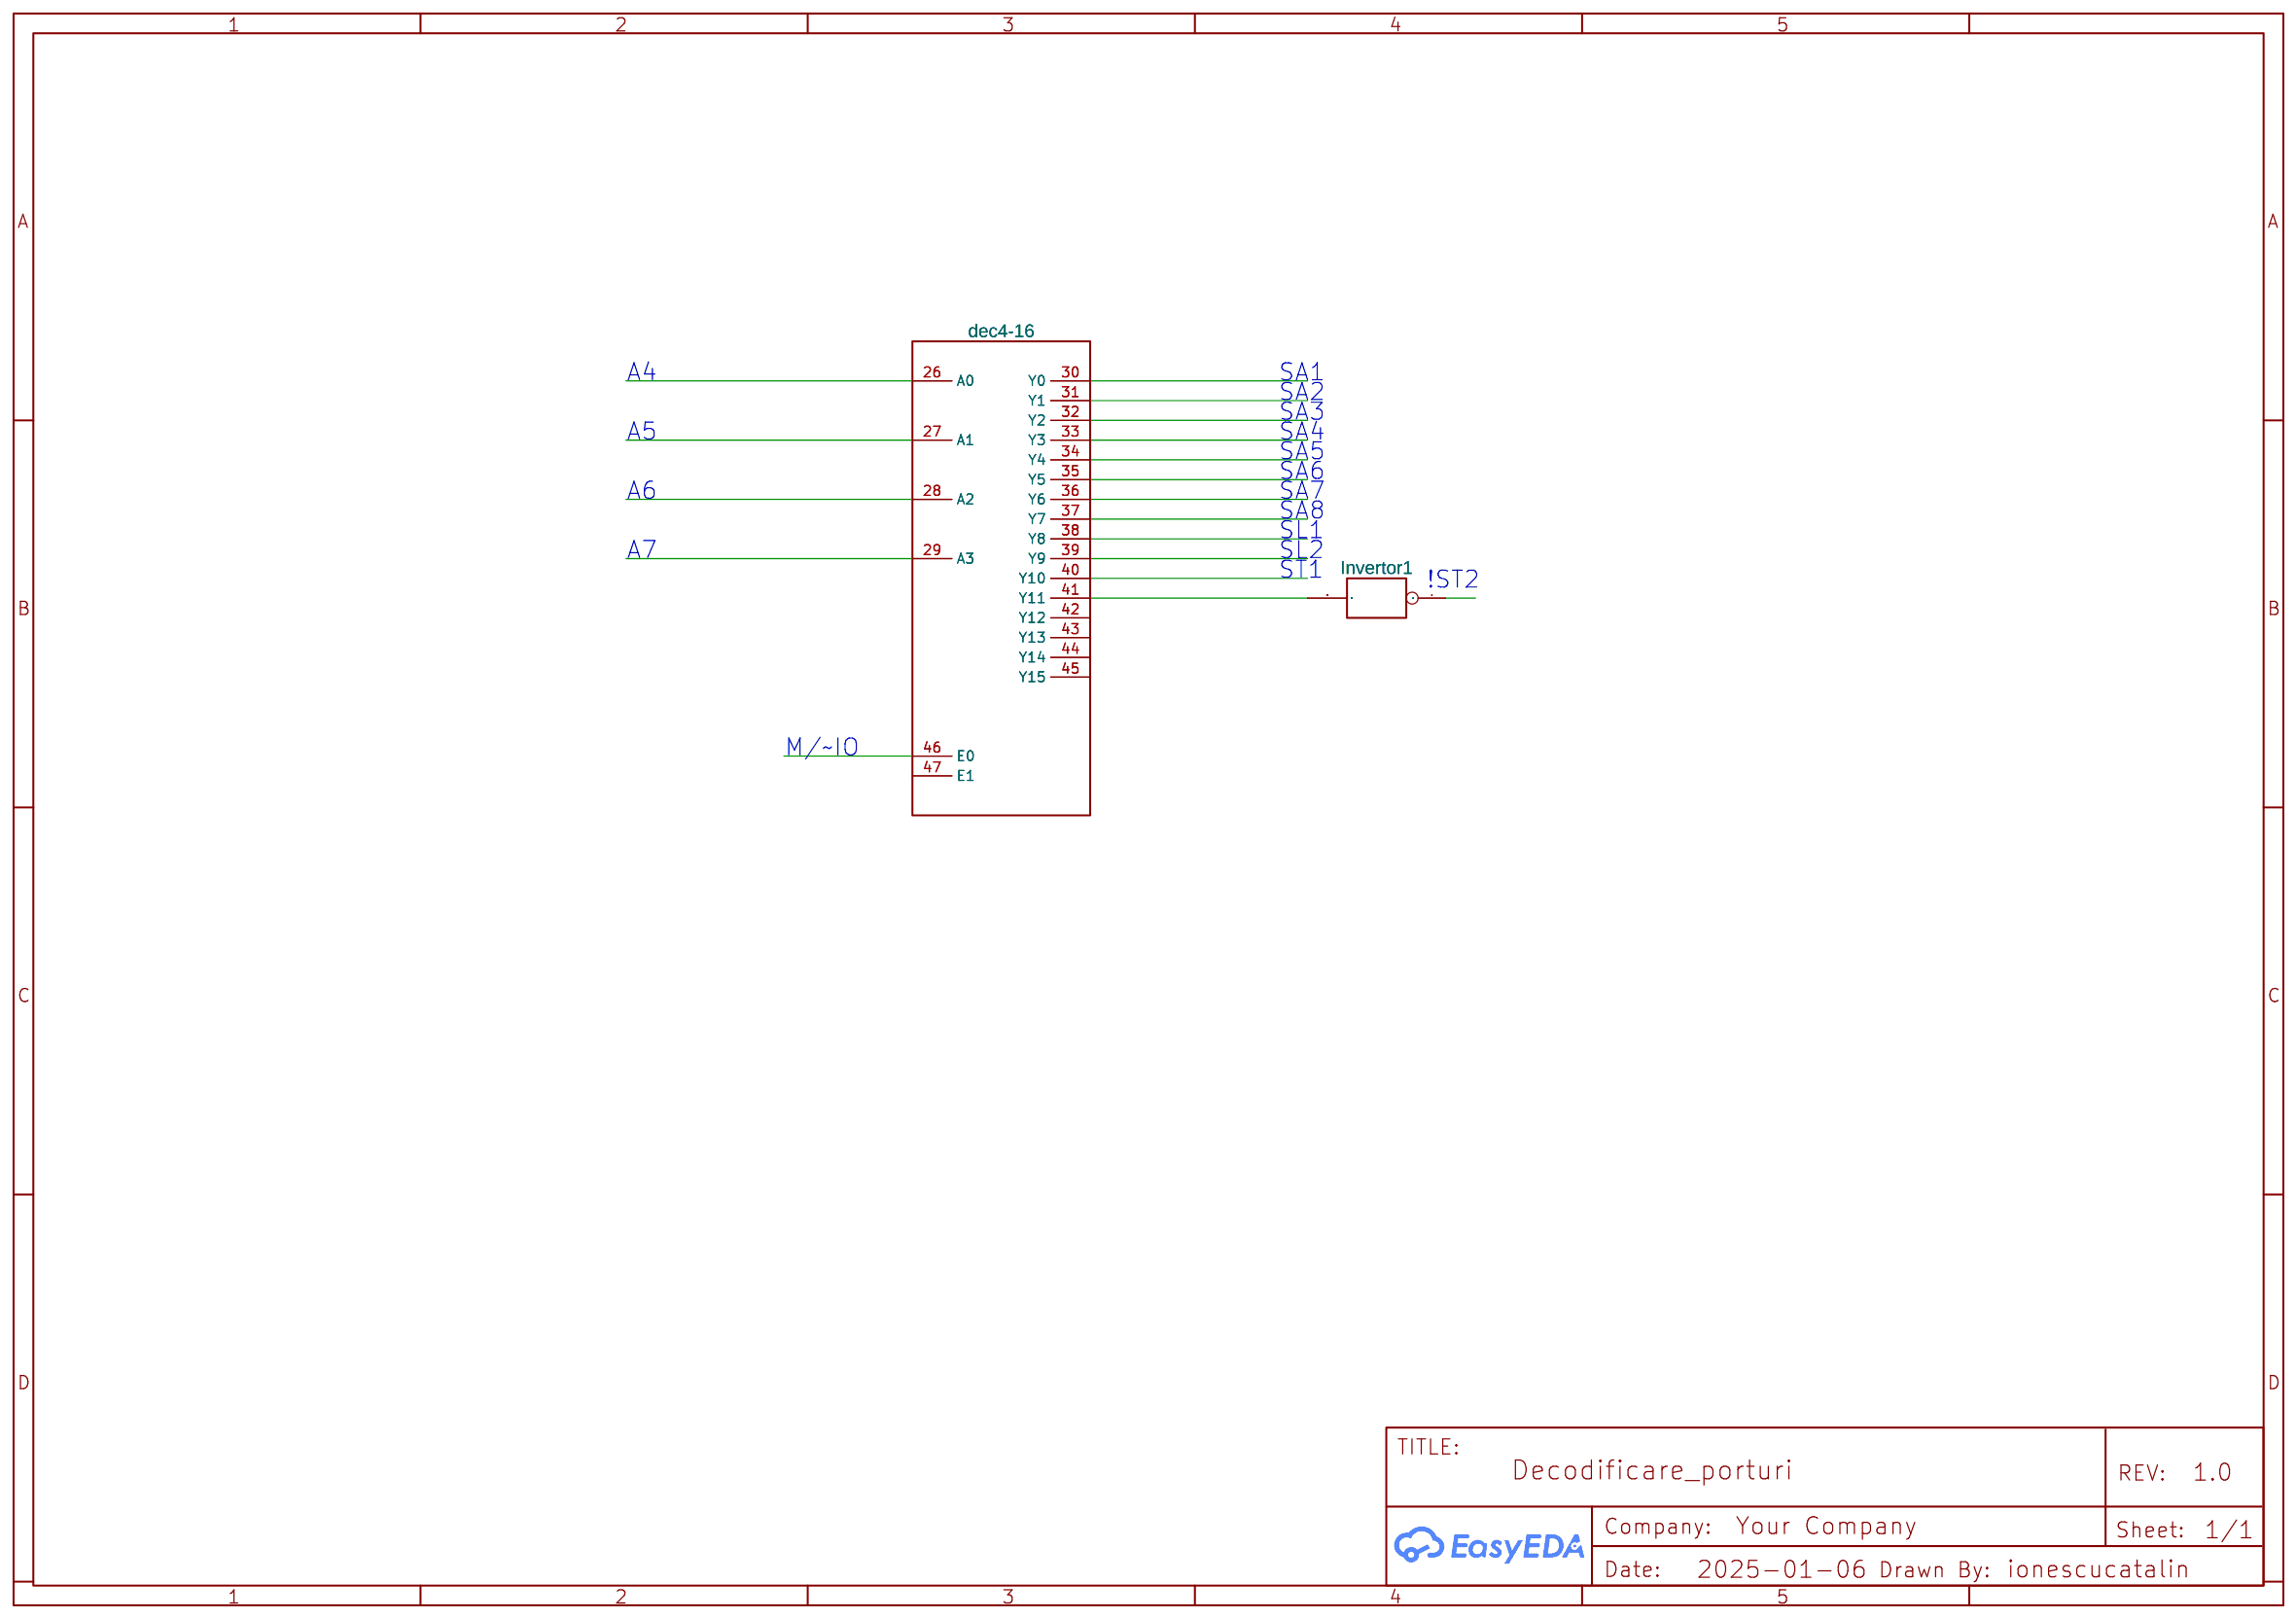
[diagram p7: Porturi_dec]

## Parts
sheet 7segdisplay
R15  1k  [R0603]
R16  1k  [R0603]
R17  1k  [R0603]
R18  1k  [R0603]
R19  1k  [R0603]
R20  1k  [R0603]
R21  1k  [R0603]
R22  1k  [R0603]
R23  1k  [R0603]
R24  1k  [R0603]
R25  1k  [R0603]
R26  1k  [R0603]
R27  1k  [R0603]
R28  1k  [R0603]
R29  1k  [R0603]
R30  1k  [R0603]
R31  1k  [R0603]
R32  1k  [R0603]
R33  1k  [R0603]
R34  1k  [R0603]
R35  1k  [R0603]
R36  1k  [R0603]
R37  1k  [R0603]
R38  1k  [R0603]
R39  1k  [R0603]
R40  1k  [R0603]
R41  1k  [R0603]
R42  1k  [R0603]
R43  1k  [R0603]
R44  1k  [R0603]
R45  1k  [R0603]
R46  1k  [R0603]
R47  1k  [R0603]
R48  1k  [R0603]
R49  1k  [R0603]
R50  1k  [R0603]
R51  1k  [R0603]
R52  1k  [R0603]
R53  1k  [R0603]
R54  1k  [R0603]
R55  1k  [R0603]
R56  1k  [R0603]
R57  1k  [R0603]
R58  1k  [R0603]
R59  1k  [R0603]
R60  1k  [R0603]
R61  1k  [R0603]
R62  1k  [R0603]
R63  1k  [R0603]
R64  1k  [R0603]
R65  1k  [R0603]
R66  1k  [R0603]
R67  1k  [R0603]
R68  1k  [R0603]
R69  1k  [R0603]
R70  1k  [R0603]
R71  1k  [R0603]
R72  1k  [R0603]
R73  1k  [R0603]
R74  1k  [R0603]
R75  1k  [R0603]
R76  1k  [R0603]
R77  1k  [R0603]
R78  1k  [R0603]
SEG1  SEG-TH_0.56×1_Cathode  [LED-SEG-TH_10P-L12.6-W19.0-P2.54-S15.24-BL]
SEG2  SEG-TH_0.56×1_Cathode  [LED-SEG-TH_10P-L12.6-W19.0-P2.54-S15.24-BL]
SEG3  SEG-TH_0.56×1_Cathode  [LED-SEG-TH_10P-L12.6-W19.0-P2.54-S15.24-BL]
SEG4  SEG-TH_0.56×1_Cathode  [LED-SEG-TH_10P-L12.6-W19.0-P2.54-S15.24-BL]
SEG5  SEG-TH_0.56×1_Cathode  [LED-SEG-TH_10P-L12.6-W19.0-P2.54-S15.24-BL]
SEG6  SEG-TH_0.56×1_Cathode  [LED-SEG-TH_10P-L12.6-W19.0-P2.54-S15.24-BL]
SEG7  SEG-TH_0.56×1_Cathode  [LED-SEG-TH_10P-L12.6-W19.0-P2.54-S15.24-BL]
SEG8  SEG-TH_0.56×1_Cathode  [LED-SEG-TH_10P-L12.6-W19.0-P2.54-S15.24-BL]
U62  74X373  [DIP20]
U63  74X373  [DIP20]
U69  74X373  [DIP20]
U70  74X373  [DIP20]
U71  74X373  [DIP20]
U72  74X373  [DIP20]
U73  74X373  [DIP20]
U74  74X373  [DIP20]
sheet ConectareaMemorilor
U9  27C512EPROM
U10  27C512EPROM
U11  62256SRAM
U12  62256SRAM
U13  7W32FUT  [TSSOP8-0D65]  (section 1)
U14  7W32FUT  [TSSOP8-0D65]  (section 1)
U15  78X138
U16  MC74HC08ADR2  [SOIC14N]  (section 3)
sheet DECINTERFATASERIALAPARA
S1  SWITCH-SPDTPTH_LOCK  [SWITCH-SPDT_LOCK.007S]
S2  SWITCH-SPDTPTH_LOCK  [SWITCH-SPDT_LOCK.007S]
U17  Invertor1
U38  78X138
sheet InterfataParalelaSeriala
C1#2  0.1u  [C0603]
C2  0.1u  [C0603]
C3  0.1u  [C0603]
C4  0.1u  [C0603]
R79  1k  [REZISTOR-0.125_WT_K]
RP1  R_3386P_EU  [RES-ADJ-TH_3386P]
U20  LCD
U57  82251
U58  8255A-PARALEL
U59  MAX232
sheet LED-URI
LED1  LED  [CHIPLED-0603-TTW]
LED2  LED  [CHIPLED-0603-TTW]
LED3  LED  [CHIPLED-0603-TTW]
LED4  LED  [CHIPLED-0603-TTW]
LED5  LED  [CHIPLED-0603-TTW]
LED6  LED  [CHIPLED-0603-TTW]
LED7  LED  [CHIPLED-0603-TTW]
LED8  LED  [CHIPLED-0603-TTW]
LED9  LED  [CHIPLED-0603-TTW]
LED10  LED  [CHIPLED-0603-TTW]
R5  1k  [R0603]
R6  1k  [R0603]
R7  1k  [R0603]
R8  1k  [R0603]
R9  1k  [R0603]
R10  1k  [R0603]
R11  1k  [R0603]
R12  1k  [R0603]
R13  1k  [R0603]
R14  1k  [R0603]
U61  74X373  [DIP20]
U68  74X373  [DIP20]
sheet MiniTast
D2  1N4007W  [SOD-123_L2.8-W1.8-LS3.7-RD]
D3  1N4007W  [SOD-123_L2.8-W1.8-LS3.7-RD]
D4  1N4007W  [SOD-123_L2.8-W1.8-LS3.7-RD]
R2  10k  [R0603]
R3  10k  [R0603]
R4  10k  [R0603]
SW-2SWITCH  Push Button  [SMD-BUTTON]
SW-3SWITCH  Push Button  [SMD-BUTTON]
SW-4SWITCH  Push Button  [SMD-BUTTON]
SW-7SWITCH  Push Button  [SMD-BUTTON]
SW-8SWITCH  Push Button  [SMD-BUTTON]
SW-9SWITCH  Push Button  [SMD-BUTTON]
SW-11SWITCH  Push Button  [SMD-BUTTON]
SW-12SWITCH  Push Button  [SMD-BUTTON]
SW-13SWITCH  Push Button  [SMD-BUTTON]
U60  74LS244
U66  74X373  [DIP20]
sheet Porturi_dec
U18  dec4-16
U19  Invertor1
sheet Unitatea Centrala
C1  0.1u  [C0603]
D1  1N4007W  [SOD-123_L2.8-W1.8-LS3.7-RD]
KEY1  K2-3.6×6.1_SMD  [KEY-SMD_2P-L6.2-W3.6-LS8.0]
R1  1k  [R0603]
U1  8284A
U2  8086_microprocessor
U3  32.768kHz  [OSC-TH_BD2.0-P0.70-D0.3]
U4  74LS373
U5  74LS373
U6  74LS373
U7  74LS245
U8  74LS245

## Library data of the parts
R1-R78 = R_0603_EU: Contributor: LCEDA_Lib
SEG1-SEG8 = SEG-TH_0.56×1_Cathode: Manufacturer: 志浩; Supplier Part: C8093; Contributor: LCEDA_01
U61-U63 U66 U68-U74 = 74X373N: Octal Transparent Latch with 3-State Outputs; Contributor: Rhyno
U9 U10 = 27C512EPROM: Contributor: ionescucatalin
U11 U12 = 62256SRAM: Contributor: ionescucatalin
U13 U14 = 7W32FUT: subpart_no: 1
U15 U38 = 78X138: Contributor: ionescucatalin
U16 = MC74HC08ADR2: Quad 2-Input AND Gate; subpart_no: 3
S1 S2 = SWITCH-SPDTPTH_LOCK: SPDT Switch; Contributor: SparkFun
U17 U19 = Invertor1: Contributor: Мария Бутыгина
C1#2 C2-C4 = C_0603_EU: Contributor: LCEDA_Lib
R79 = 0.125Wt_d: Manufacturer Part: 0.125Wt_k; Supplier Part: undefined; Contributor: titusmarin
RP1 = R_3386P_EU: Supplier: LCSC; Contributor: LCEDA_Lib; Value(Ω): 10K
U20 = LCD: Contributor: ionescucatalin
U57 = 82251: Contributor: ionescucatalin
U58 = 8255A-PARALEL: Contributor: ionescucatalin
U59 = MAX232: Contributor: ionescucatalin
LED1-LED10 = LED: Contributor: Adafruit
D1-D4 = 1N4007W: Supplier: LCSC; Supplier Part: C328592; Manufacturer: BLUE ROCKET; Contributor: LCEDA_Lib
SW-2SWITCH SW-3SWITCH SW-4SWITCH SW-7SWITCH SW-8SWITCH SW-9SWITCH SW-11SWITCH SW-12SWITCH SW-13SWITCH = -: sourceId: M82WewO60; Supplier Part: COM-08720; Supplier: SparkFun; Manufacturer Part: ?
U60 = 74LS244: Contributor: ionescucatalin
U18 = dec4-16: Contributor: Guest
C1 = C_0603_US: Contributor: LCEDA_Lib
KEY1 = K2-3.6×6.1_SMD: Supplier Part: C118141; Supplier: LCSC; Manufacturer Part: K2-1107ST-A4SW-06; Contributor: LCEDA_Lib; 制造商: 韩国韩荣
U1 = 8284A: Contributor: ionescucatalin
U2 = 8086_microprocessor: Manufacturer Part: 8086intel; Contributor: ionescucatalin
U3 = 01.X.TB.11JJVF000327680: Supplier: LCSC; Supplier Part: C7570511; Manufacturer: CREC(晶宝); Contributor: lcsc
U4-U6 = 74LS373: Contributor: ionescucatalin
U7 U8 = 74LS245: Contributor: ionescucatalin

## Nets
GND: C1.1 C2.1 C4.2 KEY1.1 RP1.3 U1.6(RDY1) U1.7(!AEN) U1.14(C1) U1.15(C2) U1.17(GND) U2.43(GND) U3.1(OSC1) U3.2(OSC2) U4.9(!OC) U5.9(!OC) U6.6(5D) U6.7(6D) U6.8(7D) U6.9(!OC) U6.16(5Q) U6.17(6Q) U6.18(7Q) U9.26(GND) U10.26(GND) U11.28(GND) U12.28(GND) U15.4(!E1) U15.5(!E2) U59.4(C2-) U60.4(A3) U60.9(Y3) U61.11(OC) U62.11(OC) U63.11(OC) U66.8(3D) U66.9(3Q) U66.11(OC) U66.12(4Q) U66.13(4D) U66.14(5D) U66.15(5Q) U66.16(6Q) U66.17(6D) U66.18(7D) U66.19(7Q) U68.11(OC) U69.11(OC) U70.11(OC) U71.11(OC) U72.11(OC) U73.11(OC) U74.11(OC)
VCC: C1#2.2 C3.2 D1.1 R1.2 R2.1 R3.1 R4.1 R5.2 R6.2 R7.2 R8.2 R9.2 R10.2 R11.2 R12.2 R13.2 R14.2 R79.1 RP1.1 SEG1.8(G2) SEG2.8(G2) SEG3.8(G2) SEG4.8(G2) SEG5.8(G2) SEG6.8(G2) SEG7.8(G2) SEG8.8(G2) U1.16(VCC) U2.42(VCC) U9.17(VCC) U10.17(VCC) U11.16(VCC) U12.16(VCC) U59.1(C1+)
Net-(C1#2-1): C1#2.1 U59.2(C2-)
Net-(C1-2): C1.2 D1.2 KEY1.2 R1.1 U1.5(!RES)
Net-(C2-2): C2.2 U59.3(C2+)
Net-(C3-1): C3.1 U59.10(V+)
Net-(C4-1): C4.1 U59.11(V-)
Net-(D2-1): D2.1 U66.2(0Q)
Net-(D2-2): D2.2 SW-2SWITCH.1(P$1) SW-9SWITCH.1(P$1) SW-13SWITCH.1(P$1)
Net-(D3-1): D3.1 U66.5(1Q)
Net-(D3-2): D3.2 SW-3SWITCH.1(P$1) SW-8SWITCH.1(P$1) SW-12SWITCH.1(P$1)
Net-(D4-1): D4.1 U66.6(2Q)
Net-(D4-2): D4.2 SW-4SWITCH.1(P$1) SW-7SWITCH.1(P$1) SW-11SWITCH.1(P$1)
Net-(LED1-A@1): LED1.A@1(A) R6.1
Net-(LED1-C@1): LED1.C@1(C) U68.2(0Q)
Net-(LED2-A@1): LED2.A@1(A) R7.1
Net-(LED2-C@1): LED2.C@1(C) U68.5(1Q)
Net-(LED3-A@1): LED3.A@1(A) R8.1
Net-(LED3-C@1): LED3.C@1(C) U68.6(2Q)
Net-(LED4-A@1): LED4.A@1(A) R9.1
Net-(LED4-C@1): LED4.C@1(C) U68.9(3Q)
Net-(LED5-A@1): LED5.A@1(A) R5.1
Net-(LED5-C@1): LED5.C@1(C) U61.2(0Q)
Net-(LED6-A@1): LED6.A@1(A) R11.1
Net-(LED6-C@1): LED6.C@1(C) U61.5(1Q)
Net-(LED7-A@1): LED7.A@1(A) R12.1
Net-(LED7-C@1): LED7.C@1(C) U61.6(2Q)
Net-(LED8-A@1): LED8.A@1(A) R10.1
Net-(LED8-C@1): LED8.C@1(C) U68.12(4Q)
Net-(LED9-A@1): LED9.A@1(A) R13.1
Net-(LED9-C@1): LED9.C@1(C) U61.9(3Q)
Net-(LED10-A@1): LED10.A@1(A) R14.1
Net-(LED10-C@1): LED10.C@1(C) U61.12(4Q)
Net-(R2-2): R2.2 SW-2SWITCH.2(P$2) SW-3SWITCH.2(P$2) SW-4SWITCH.2(P$2) U60.1(A0)
Net-(R3-2): R3.2 SW-7SWITCH.2(P$2) SW-9SWITCH.2(P$2) U60.2(A1)
Net-(R4-2): R4.2 SW-11SWITCH.2(P$2) SW-13SWITCH.2(P$2) U60.3(A2)
Net-(R15-1): R15.1 U69.5(1Q)
Net-(R15-2): R15.2 SEG1.6(B)
Net-(R16-1): R16.1 U69.6(2Q)
Net-(R16-2): R16.2 SEG1.4(C)
Net-(R17-1): R17.1 U69.9(3Q)
Net-(R17-2): R17.2 SEG1.2(D)
Net-(R18-1): R18.1 U69.12(4Q)
Net-(R18-2): R18.2 SEG1.1(E)
Net-(R19-1): R19.1 U69.15(5Q)
Net-(R19-2): R19.2 SEG1.9(F)
Net-(R20-1): R20.1 U69.16(6Q)
Net-(R20-2): R20.2 SEG1.10(G)
Net-(R21-1): R21.1 U69.19(7Q)
Net-(R21-2): R21.2 SEG1.5(DP)
Net-(R22-1): R22.1 U70.19(7Q)
Net-(R22-2): R22.2 SEG2.5(DP)
Net-(R23-1): R23.1 U70.16(6Q)
Net-(R23-2): R23.2 SEG2.10(G)
Net-(R24-1): R24.1 U70.15(5Q)
Net-(R24-2): R24.2 SEG2.9(F)
Net-(R25-1): R25.1 U70.12(4Q)
Net-(R25-2): R25.2 SEG2.1(E)
Net-(R26-1): R26.1 U70.9(3Q)
Net-(R26-2): R26.2 SEG2.2(D)
Net-(R27-1): R27.1 U70.6(2Q)
Net-(R27-2): R27.2 SEG2.4(C)
Net-(R28-1): R28.1 U70.5(1Q)
Net-(R28-2): R28.2 SEG2.6(B)
Net-(R29-1): R29.1 U70.2(0Q)
Net-(R29-2): R29.2 SEG2.7(A)
Net-(R30-1): R30.1 U71.19(7Q)
Net-(R30-2): R30.2 SEG3.5(DP)
Net-(R31-1): R31.1 U71.16(6Q)
Net-(R31-2): R31.2 SEG3.10(G)
Net-(R32-1): R32.1 U71.15(5Q)
Net-(R32-2): R32.2 SEG3.9(F)
Net-(R33-1): R33.1 U71.12(4Q)
Net-(R33-2): R33.2 SEG3.1(E)
Net-(R34-1): R34.1 U71.9(3Q)
Net-(R34-2): R34.2 SEG3.2(D)
Net-(R35-1): R35.1 U71.6(2Q)
Net-(R35-2): R35.2 SEG3.4(C)
Net-(R36-1): R36.1 U71.5(1Q)
Net-(R36-2): R36.2 SEG3.6(B)
Net-(R37-1): R37.1 U71.2(0Q)
Net-(R37-2): R37.2 SEG3.7(A)
Net-(R38-1): R38.1 U74.19(7Q)
Net-(R38-2): R38.2 SEG4.5(DP)
Net-(R39-1): R39.1 U74.16(6Q)
Net-(R39-2): R39.2 SEG4.10(G)
Net-(R40-1): R40.1 U74.15(5Q)
Net-(R40-2): R40.2 SEG4.9(F)
Net-(R41-1): R41.1 U74.12(4Q)
Net-(R41-2): R41.2 SEG4.1(E)
Net-(R42-1): R42.1 U74.9(3Q)
Net-(R42-2): R42.2 SEG4.2(D)
Net-(R43-1): R43.1 U74.6(2Q)
Net-(R43-2): R43.2 SEG4.4(C)
Net-(R44-1): R44.1 U74.5(1Q)
Net-(R44-2): R44.2 SEG4.6(B)
Net-(R45-1): R45.1 U74.2(0Q)
Net-(R45-2): R45.2 SEG4.7(A)
Net-(R46-1): R46.1 U73.19(7Q)
Net-(R46-2): R46.2 SEG5.5(DP)
Net-(R47-1): R47.1 U73.16(6Q)
Net-(R47-2): R47.2 SEG5.10(G)
Net-(R48-1): R48.1 U73.15(5Q)
Net-(R48-2): R48.2 SEG5.9(F)
Net-(R49-1): R49.1 U73.12(4Q)
Net-(R49-2): R49.2 SEG5.1(E)
Net-(R50-1): R50.1 U73.9(3Q)
Net-(R50-2): R50.2 SEG5.2(D)
Net-(R51-1): R51.1 U73.6(2Q)
Net-(R51-2): R51.2 SEG5.4(C)
Net-(R52-1): R52.1 U73.5(1Q)
Net-(R52-2): R52.2 SEG5.6(B)
Net-(R53-1): R53.1 U73.2(0Q)
Net-(R53-2): R53.2 SEG5.7(A)
Net-(R54-1): R54.1 U72.19(7Q)
Net-(R54-2): R54.2 SEG6.5(DP)
Net-(R55-1): R55.1 U72.16(6Q)
Net-(R55-2): R55.2 SEG6.10(G)
Net-(R56-1): R56.1 U72.15(5Q)
Net-(R56-2): R56.2 SEG6.9(F)
Net-(R57-1): R57.1 U72.12(4Q)
Net-(R57-2): R57.2 SEG6.1(E)
Net-(R58-1): R58.1 U72.9(3Q)
Net-(R58-2): R58.2 SEG6.2(D)
Net-(R59-1): R59.1 U72.6(2Q)
Net-(R59-2): R59.2 SEG6.4(C)
Net-(R60-1): R60.1 U72.5(1Q)
Net-(R60-2): R60.2 SEG6.6(B)
Net-(R61-1): R61.1 U72.2(0Q)
Net-(R61-2): R61.2 SEG6.7(A)
Net-(R62-1): R62.1 U69.2(0Q)
Net-(R62-2): R62.2 SEG1.7(A)
Net-(R63-1): R63.1 U62.19(7Q)
Net-(R63-2): R63.2 SEG7.5(DP)
Net-(R64-1): R64.1 U62.16(6Q)
Net-(R64-2): R64.2 SEG7.10(G)
Net-(R65-1): R65.1 U62.15(5Q)
Net-(R65-2): R65.2 SEG7.9(F)
Net-(R66-1): R66.1 U62.12(4Q)
Net-(R66-2): R66.2 SEG7.1(E)
Net-(R67-1): R67.1 U62.9(3Q)
Net-(R67-2): R67.2 SEG7.2(D)
Net-(R68-1): R68.1 U62.6(2Q)
Net-(R68-2): R68.2 SEG7.4(C)
Net-(R69-1): R69.1 U62.5(1Q)
Net-(R69-2): R69.2 SEG7.6(B)
Net-(R70-1): R70.1 U62.2(0Q)
Net-(R70-2): R70.2 SEG7.7(A)
Net-(R71-1): R71.1 U63.19(7Q)
Net-(R71-2): R71.2 SEG8.5(DP)
Net-(R72-1): R72.1 U63.16(6Q)
Net-(R72-2): R72.2 SEG8.10(G)
Net-(R73-1): R73.1 U63.15(5Q)
Net-(R73-2): R73.2 SEG8.9(F)
Net-(R74-1): R74.1 U63.12(4Q)
Net-(R74-2): R74.2 SEG8.1(E)
Net-(R75-1): R75.1 U63.9(3Q)
Net-(R75-2): R75.2 SEG8.2(D)
Net-(R76-1): R76.1 U63.6(2Q)
Net-(R76-2): R76.2 SEG8.4(C)
Net-(R77-1): R77.1 U63.5(1Q)
Net-(R77-2): R77.2 SEG8.6(B)
Net-(R78-1): R78.1 U63.2(0Q)
Net-(R78-2): R78.2 SEG8.7(A)
Net-(S1-1): S1.1(O) U38.8(!Y1)
Net-(S1-3): S1.3(S) U38.7(!Y0)
Net-(S2-1): S2.1(O) U38.13(!Y6)
Net-(S2-3): S2.3(S) U38.9(!Y2)
Net-(U1-8): U1.8(CLK) U2.7(CLK)
Net-(U1-9): U1.9(READY) U2.8(READY)
Net-(U1-10): U1.10(RESET) U2.9(RESET)
Net-(U2-16): U2.16(!BHE) U6.5(4D)
Net-(U2-17): U2.17(ALE) U4.10(G) U5.10(G) U6.10(G)
Net-(U2-18): U2.18(DT/!R) U7.9(DIR) U8.9(DIR)
Net-(U2-19): U2.19(!DEN) U7.10(!G) U8.10(!G)
Net-(U2-20): U2.20(AD1) U4.2(1D) U7.2(A1)
Net-(U2-21): U2.21(AD2) U4.3(2D) U7.3(A2)
Net-(U2-22): U2.22(AD3) U4.4(3D) U7.4(A3)
Net-(U2-23): U2.23(AD4) U4.5(4D) U7.5(A4)
Net-(U2-24): U2.24(AD5) U4.6(5D) U7.6(A5)
Net-(U2-25): U2.25(AD6) U4.7(6D) U7.7(A6)
Net-(U2-26): U2.26(AD7) U4.8(7D) U7.8(A7)
Net-(U2-27): U2.27(AD8) U5.1(0D) U8.1(A0)
Net-(U2-28): U2.28(AD9) U5.2(1D) U8.2(A1)
Net-(U2-29): U2.29(AD10) U5.3(2D) U8.3(A2)
Net-(U2-30): U2.30(AD11) U5.4(3D) U8.4(A3)
Net-(U2-31): U2.31(AD12) U5.5(4D) U8.5(A4)
Net-(U2-32): U2.32(AD13) U5.6(5D) U8.6(A5)
Net-(U2-33): U2.33(AD14) U5.7(6D) U8.7(A6)
Net-(U2-34): U2.34(AD15) U5.8(7D) U8.8(A7)
Net-(U2-35): U2.35(A16) U6.1(0D)
Net-(U2-36): U2.36(A17) U6.2(1D)
Net-(U2-37): U2.37(A18) U6.3(2D)
Net-(U2-38): U2.38(A19) U6.4(3D)
Net-(U2-44): U2.44(AD0) U4.1(0D) U7.1(A0)
Net-(U4-11): U4.11(0Q) U4.12(1Q) U4.13(2Q) U4.14(3Q) U4.15(4Q) U4.16(5Q) U4.17(6Q) U4.18(7Q) U5.11(0Q) U5.12(1Q) U5.13(2Q) U5.14(3Q) U5.15(4Q) U5.16(5Q) U5.17(6Q) U5.18(7Q) U6.11(0Q) U6.12(1Q) U6.13(2Q) U6.14(3Q)
Net-(U9-1): U9.1(A0) U10.1(A0)
Net-(U9-2): U9.2(A1) U9.3(A2) U9.4(A3) U9.5(A4) U9.6(A5) U9.7(A6) U9.8(A7) U9.9(A8) U9.10(A9) U9.11(A10) U9.12(A11) U9.13(A12) U9.14(A13) U9.15(A14) U9.16(A15) U10.2(A1) U10.3(A2) U10.4(A3) U10.5(A4) U10.6(A5) U10.7(A6) U10.8(A7) U10.9(A8) U10.10(A9) U10.11(A10) U10.12(A11) U10.13(A12) U10.14(A13) U10.15(A14) U10.16(A15) U11.1(A0) U11.2(A1) U11.3(A2) U11.4(A3) U11.5(A4) U11.6(A5) U11.7(A6) U11.8(A7) U11.9(A8) U11.10(A9) U11.11(A10) U11.12(A11) U11.13(A12) U11.14(A13) U11.15(A14) U12.1(A0) U12.2(A1) U12.3(A2) U12.4(A3) U12.5(A4) U12.6(A5) U12.7(A6) U12.8(A7) U12.9(A8) U12.10(A9) U12.11(A10) U12.12(A11) U12.13(A12) U12.14(A13) U12.15(A14)
Net-(U9-18): U9.18(D0) U9.19(D1) U9.20(D2) U9.21(D3) U9.22(D4) U9.23(D5) U9.24(D6) U9.25(D7) U10.18(D0) U10.19(D1) U10.20(D2) U10.21(D3) U10.22(D4) U10.23(D5) U10.24(D6) U10.25(D7) U11.17(D0) U11.18(D1) U11.19(D2) U11.20(D3) U11.21(D4) U11.22(D5) U11.23(D6) U11.24(D7) U12.17(D0) U12.18(D1) U12.19(D2) U12.20(D3) U12.21(D4) U12.22(D5) U12.23(D6) U12.24(D7)
Net-(U9-28): U9.28(!CE) U10.28(!CE) U15.7(!Y0)
Net-(U9-29): U9.29(!OE) U10.29(!OE) U11.26(!OE) U12.26(!OE)
Net-(U11-25): U11.25(!WE) U14.7(OUT)
Net-(U11-27): U11.27(!CS) U12.27(!CS) U16.11(Y)
Net-(U12-25): U12.25(!WE) U13.7(OUT)
Net-(U13.1-2): U13.2(B) U14.1(A)
Net-(U15-8): U15.8(!Y1) U16.12(A)
Net-(U17-1): U17.1 U38.4(!E1)
Net-(U17-2): U17.2 U38.5(!E2)
Net-(U18-41): U18.41(Y11) U19.2
Net-(U57-1): U57.1(D0) U57.2(D1) U57.3(D2) U57.4(D3) U57.5(D4) U57.6(D5) U57.7(D6) U57.8(D7) U58.1(D0) U58.2(D1) U58.3(D2) U58.4(D3) U58.5(D4) U58.6(D5) U58.7(D6) U58.8(D7)
Net-(U57-11): U57.11(!RD) U58.9(RD)
Net-(U57-12): U57.12(!WR) U58.10(WR)
Net-(U57-13): U57.13(C/!D) U58.12(A0)
Net-(U57-14): U57.14(RESET) U58.14(RESET)
Net-(U57-16): U57.16(TxD) U59.5(T1IN)
Net-(U57-17): U57.17(RxD) U59.8(R2OUT)
Net-(U57-18): U57.18(!RxD) U57.19(!TxC)
Net-(U58-24): U58.24(PB0) U58.25(PB1) U58.26(PB2) U58.27(PB3) U58.28(PB4) U58.29(PB5) U58.30(PB6) U58.31(PB7)
Net-(U58-32): U58.32(PC0) U58.33(PC1) U58.34(PC2) U58.35(PC3) U58.36(PC4) U58.37(PC5) U58.38(PC6) U58.39(PC7)
Net-(U59-6): U59.6(T2IN) U59.13(T2OUT)
Net-(U59-7): U59.7(R1OUT) U59.14(R1IN)
Net-(U61-3): U61.3(0D) U68.3(0D)
Net-(U61-4): U61.4(1D) U68.4(1D)
Net-(U61-7): U61.7(2D) U68.7(2D)
Net-(U61-8): U61.8(3D) U68.8(3D)
Net-(U61-13): U61.13(4D) U68.13(4D)
Net-(U61-14): U61.14(5D) U68.14(5D)
Net-(U61-17): U61.17(6D) U68.17(6D)
Net-(U61-18): U61.18(7D) U68.18(7D)

Not connected (* = marked no-connect by the designer): R79 2; RP1 2; S1 2(P); S2 2(P); SEG1 3(G1); SEG2 3(G1); SEG3 3(G1); SEG4 3(G1); SEG5 3(G1); SEG6 3(G1); SEG7 3(G1); SEG8 3(G1); SW-8SWITCH 2(P$2); SW-12SWITCH 2(P$2); U1 11(PCLK); U2 10(MN/!MX) 39(!RD) 40(!WR) 41(M/!IO); U6 15(4Q); U7 11(B0) 12(B1) 13(B2) 14(B3) 15(B4) 16(B5) 17(B6) 18(B7); U8 11(B0) 12(B1) 13(B2) 14(B3) 15(B4) 16(B5) 17(B6) 18(B7); U13 1(A); U14 2(B); U15 1(A0) 2(A1) 3(A2) 6(E3) 9(!Y2) 10(!Y3) 11(!Y4) 12(!Y5) 13(!Y6) 14(!Y7); U16 7(GND) 13(B) 14(VDD); U18 26(A0) 27(A1) 28(A2) 29(A3) 30(Y0) 31(Y1) 32(Y2) 33(Y3) 34(Y4) 35(Y5) 36(Y6) 37(Y7) 38(Y8) 39(Y9) 40(Y10) 42(Y12) 43(Y13) 44(Y14) 45(Y15) 46(E0) 47(E1); U19 1; U20 1 2 3 4 5 6 7 8 9 10 11 12 13 15 16 17; U38 1(A0) 2(A1) 3(A2) 6(E3) 10(!Y3) 11(!Y4) 12(!Y5) 14(!Y7); U57 10(!CS) 15(CLK) 20(CTS); U58 11(CS) 13(A1) 15(VCC) 16(PA0) 17(PA1) 18(PA2) 19(PA3) 20(PA4) 21(PA5) 22(PA6) 23(PA7); U59 9(VCC) 12(T1OUT) 16(R2IN); U60 5(!OE) 6(Y0) 7(Y1) 8(Y2); U61 1(G) 10(GND) 15(5Q) 16(6Q) 19(7Q) 20(VCC); U62 1(G) 3(0D) 4(1D) 7(2D) 8(3D) 10(GND) 13(4D) 14(5D) 17(6D) 18(7D) 20(VCC); U63 1(G) 3(0D) 4(1D) 7(2D) 8(3D) 10(GND) 13(4D) 14(5D) 17(6D) 18(7D) 20(VCC); U66 1(G) 3(0D) 4(1D) 7(2D) 10(GND) 20(VCC); U68 1(G) 10(GND) 15(5Q) 16(6Q) 19(7Q) 20(VCC); U69 1(G) 3(0D) 4(1D) 7(2D) 8(3D) 10(GND) 13(4D) 14(5D) 17(6D) 18(7D) 20(VCC); U70 1(G) 3(0D) 4(1D) 7(2D) 8(3D) 10(GND) 13(4D) 14(5D) 17(6D) 18(7D) 20(VCC); U71 1(G) 3(0D) 4(1D) 7(2D) 8(3D) 10(GND) 13(4D) 14(5D) 17(6D) 18(7D) 20(VCC); U72 1(G) 3(0D) 4(1D) 7(2D) 8(3D) 10(GND) 13(4D) 14(5D) 17(6D) 18(7D) 20(VCC); U73 1(G) 3(0D) 4(1D) 7(2D) 8(3D) 10(GND) 13(4D) 14(5D) 17(6D) 18(7D) 20(VCC); U74 1(G) 3(0D) 4(1D) 7(2D) 8(3D) 10(GND) 13(4D) 14(5D) 17(6D) 18(7D) 20(VCC)

## Notes on the sheets
sheet 1
- ALE
- A0-A19
- ALE
- 1
- !BHE
- ALE
- DT/!R
- !DEN
- DT/!R
- !DEN
- D0-D15
sheet 2
- D0-D15
- A0
- A15-A1
- !RD
- !BHE
- A17
- A18
- A19
- A16
- !WR
- A0
- M/!IO
sheet 3
- !S55
- A8
- A9
- A11
- A1
- M/~IO
sheet 4
- D0-D7
- TxD
- RxD
- !S51
- !RD
- !WR
- A1
- RESET
- CLK
- !S55
- A2
- PB0-PB7
- PC0-PC8
sheet 5
- D0
- D1
- D2
- D0
- D1
- D2
- ST2
- ST1
sheet 6
- D0
- D1
- D2
- D3
- D4
- D5
- D6
- D7
- SL1
- SL2
sheet 7
- D0
- D1
- D2
- D3
- D4
- D5
- D6
- D7
- SA1
- D0
- D1
- D2
- D3
- D4
- D5
- D6
- D7
- SA2
- D0
- D1
- D2
- D3
- D4
- D5
- D6
- D7
- SA3
- D0
- D1
- D2
- D3
- D4
- D5
- D6
- D7
- SA4
- D0
- D1
- D2
- D3
- D4
- D5
- D6
- D7
- SA5
- D0
- D1
- D2
- D3
- D4
- D5
- D6
- D7
- SA6
- D0
- D1
- D2
- D3
- D4
- D5
- D6
- D7
- SA7
- D0
- D1
- D2
- D3
- D4
- D5
- D6
- D7
- SA8
sheet 8
- A4
- SA1
- SA2
- A5
- SA3
- SA4
- SA5
- SA6
- A6
- SA7
- SA8
- SL1
- A7
- SL2
- ST1
- !ST2
- M/~IO
